# EasyEDA Pro project Class D amp.eprj, schematic Class D amp

## Sheets
1 Power 12V DC: Board Name: MainBoard; Create Date: 2026-04-25; Page Name: Power 12V DC; Project Name: Class D amp; Schematic Name: Class D amp; Update Date: 2026-06-03; Company: zoomMediaPlus; Drawn: Igor Korzinek; Page Size: A4; Version: V1.0
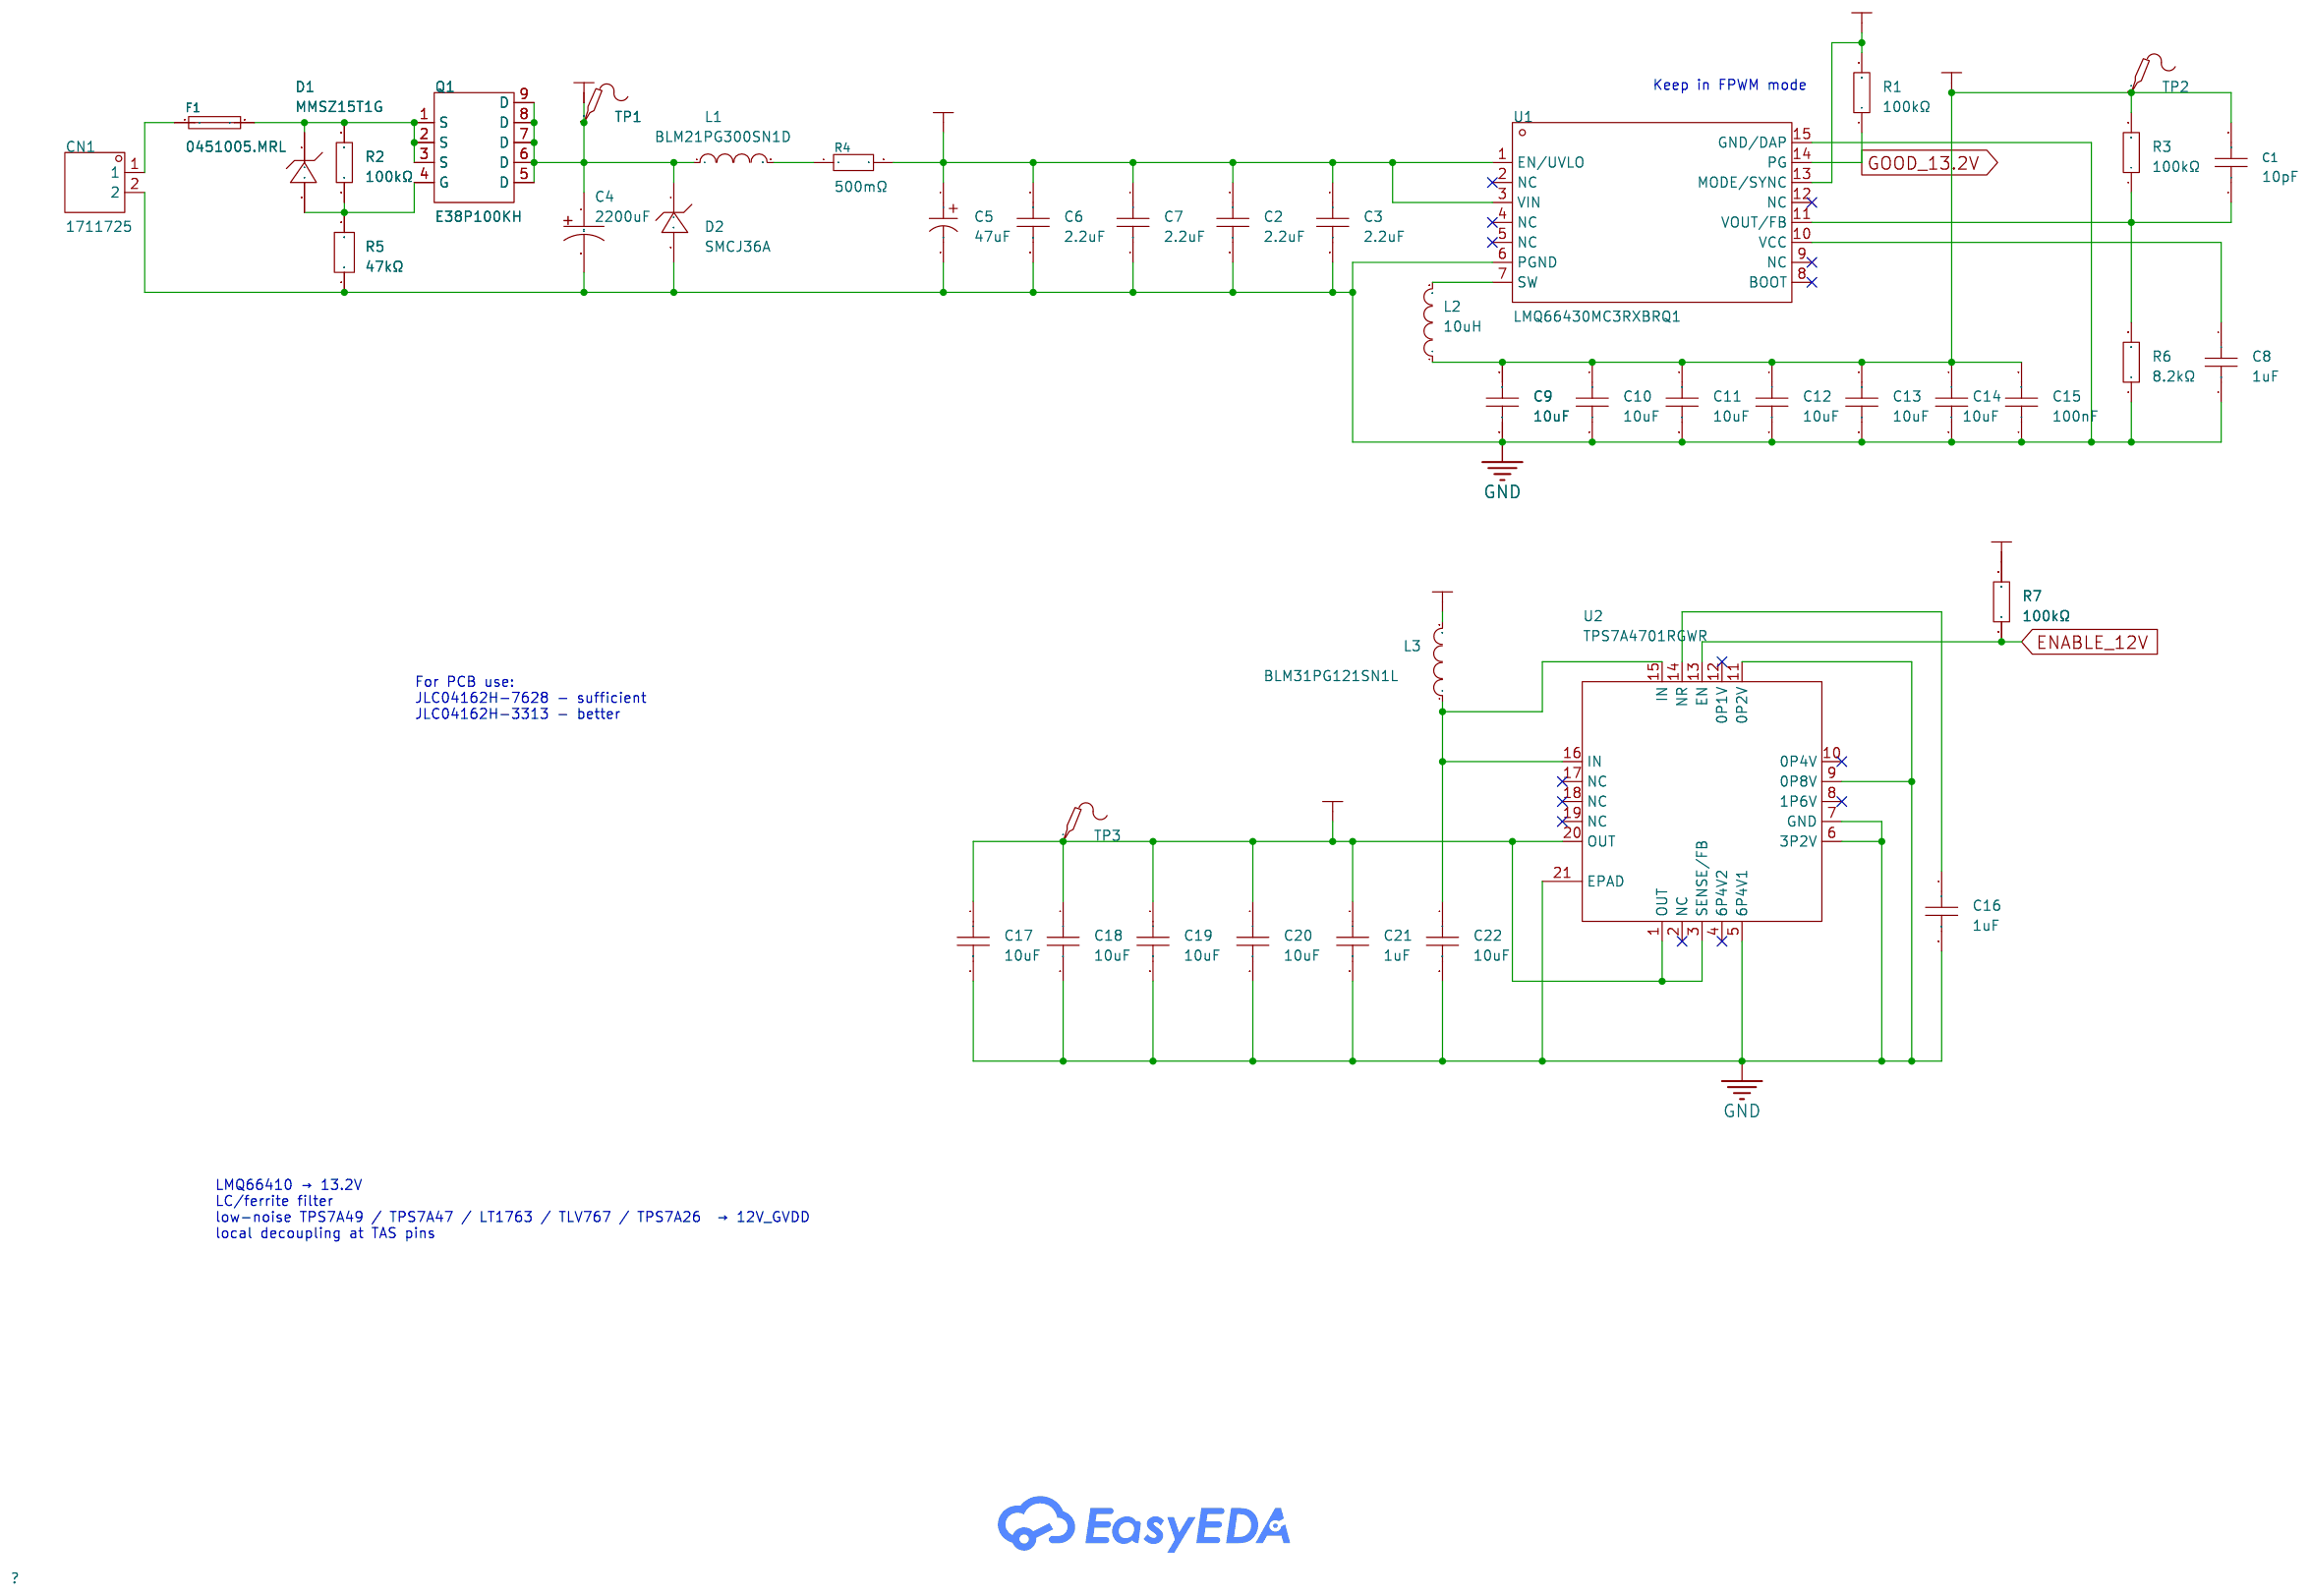
[diagram p0: Power 12V DC]
2 Power 5V DC: Page Name: Power 5V DC; Update Date: 2026-06-02; Company: EasyEDA.com
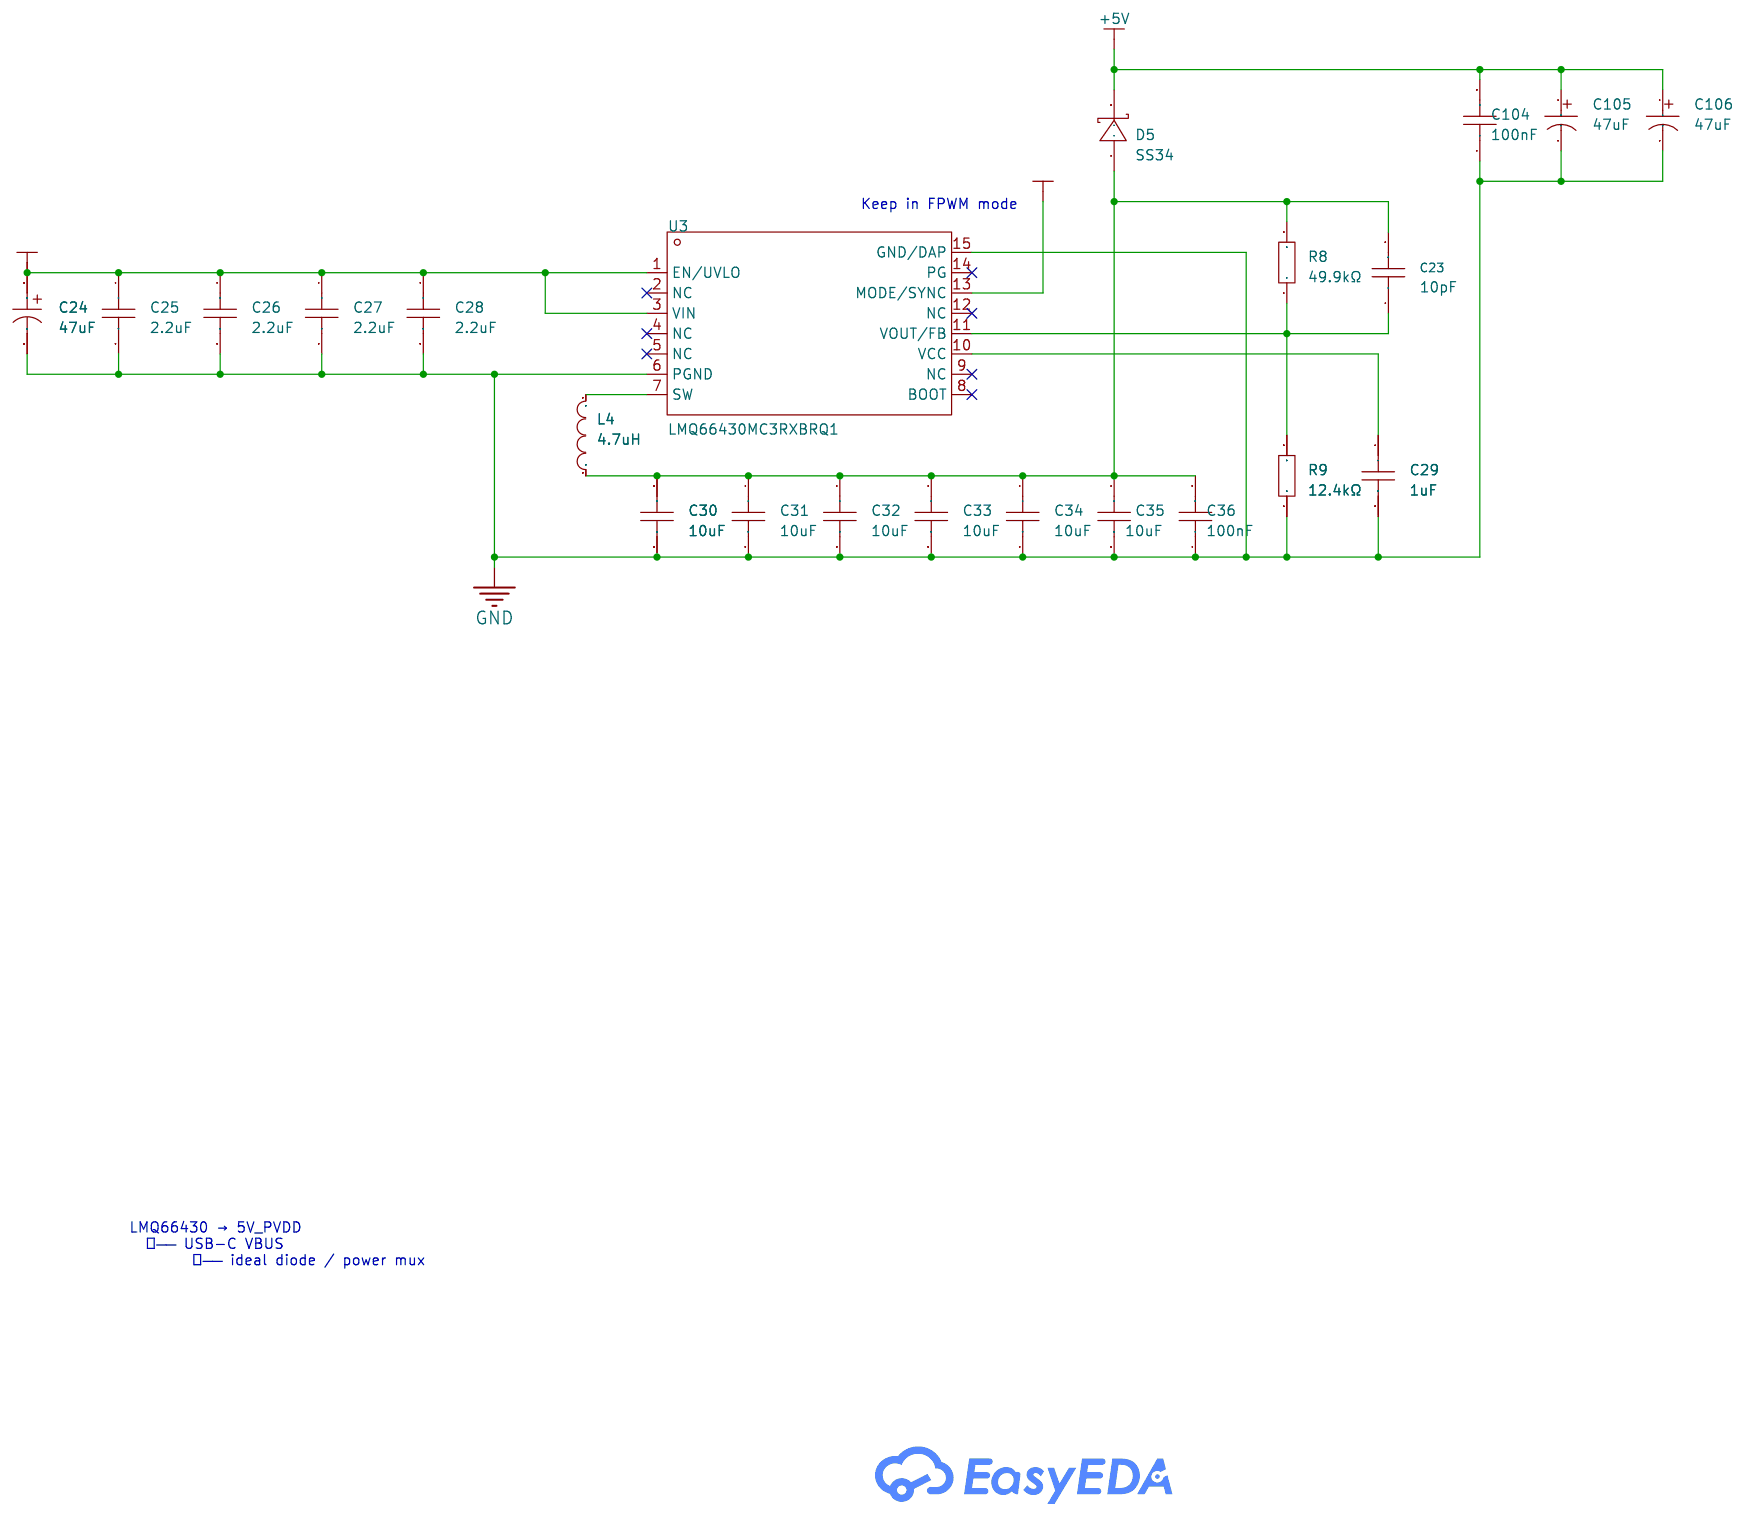
[diagram p1: Power 5V DC]
3 Power 3.3V DC: Page Name: Power 3.3V DC; Update Date: 2026-06-02; Company: EasyEDA.com
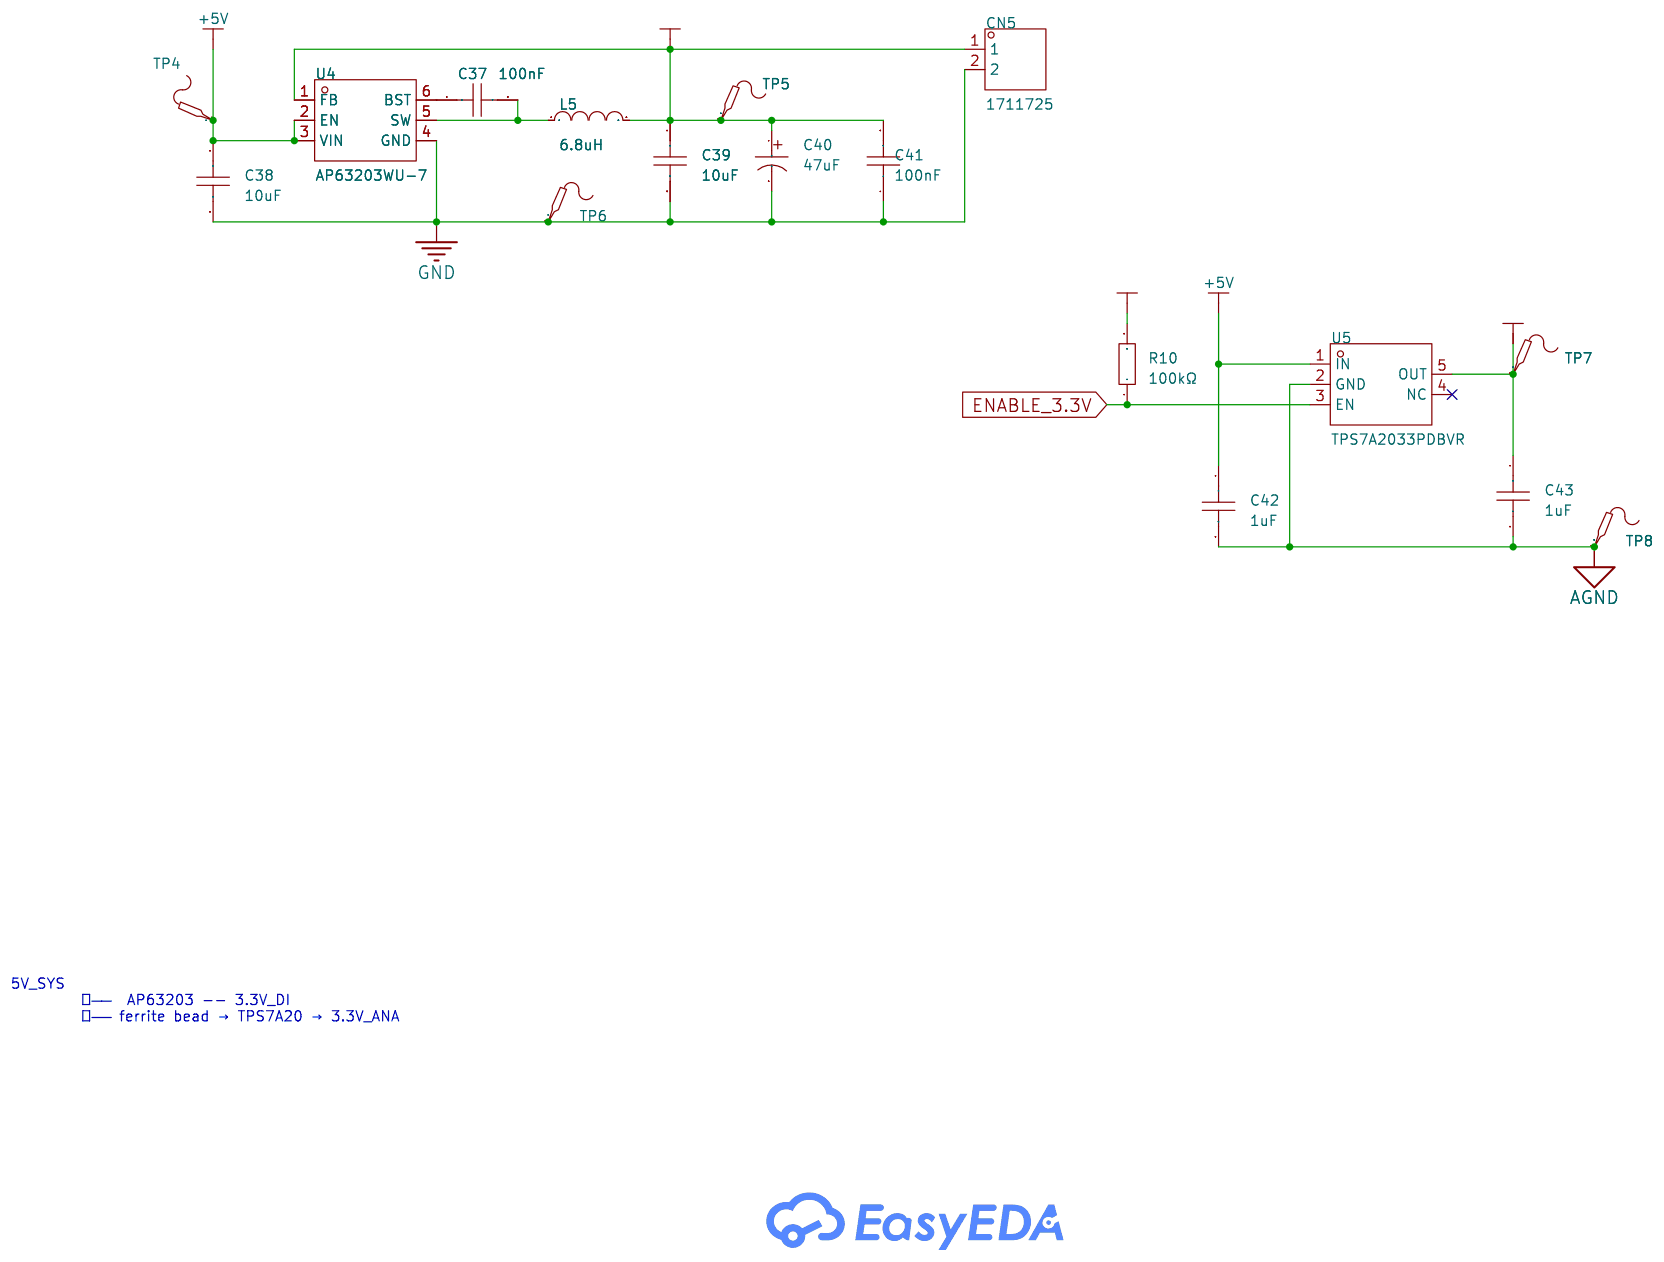
[diagram p2: Power 3.3V DC]
4 Microcontroler: Page Name: Microcontroler; Update Date: 2026-06-05; Company: EasyEDA.com
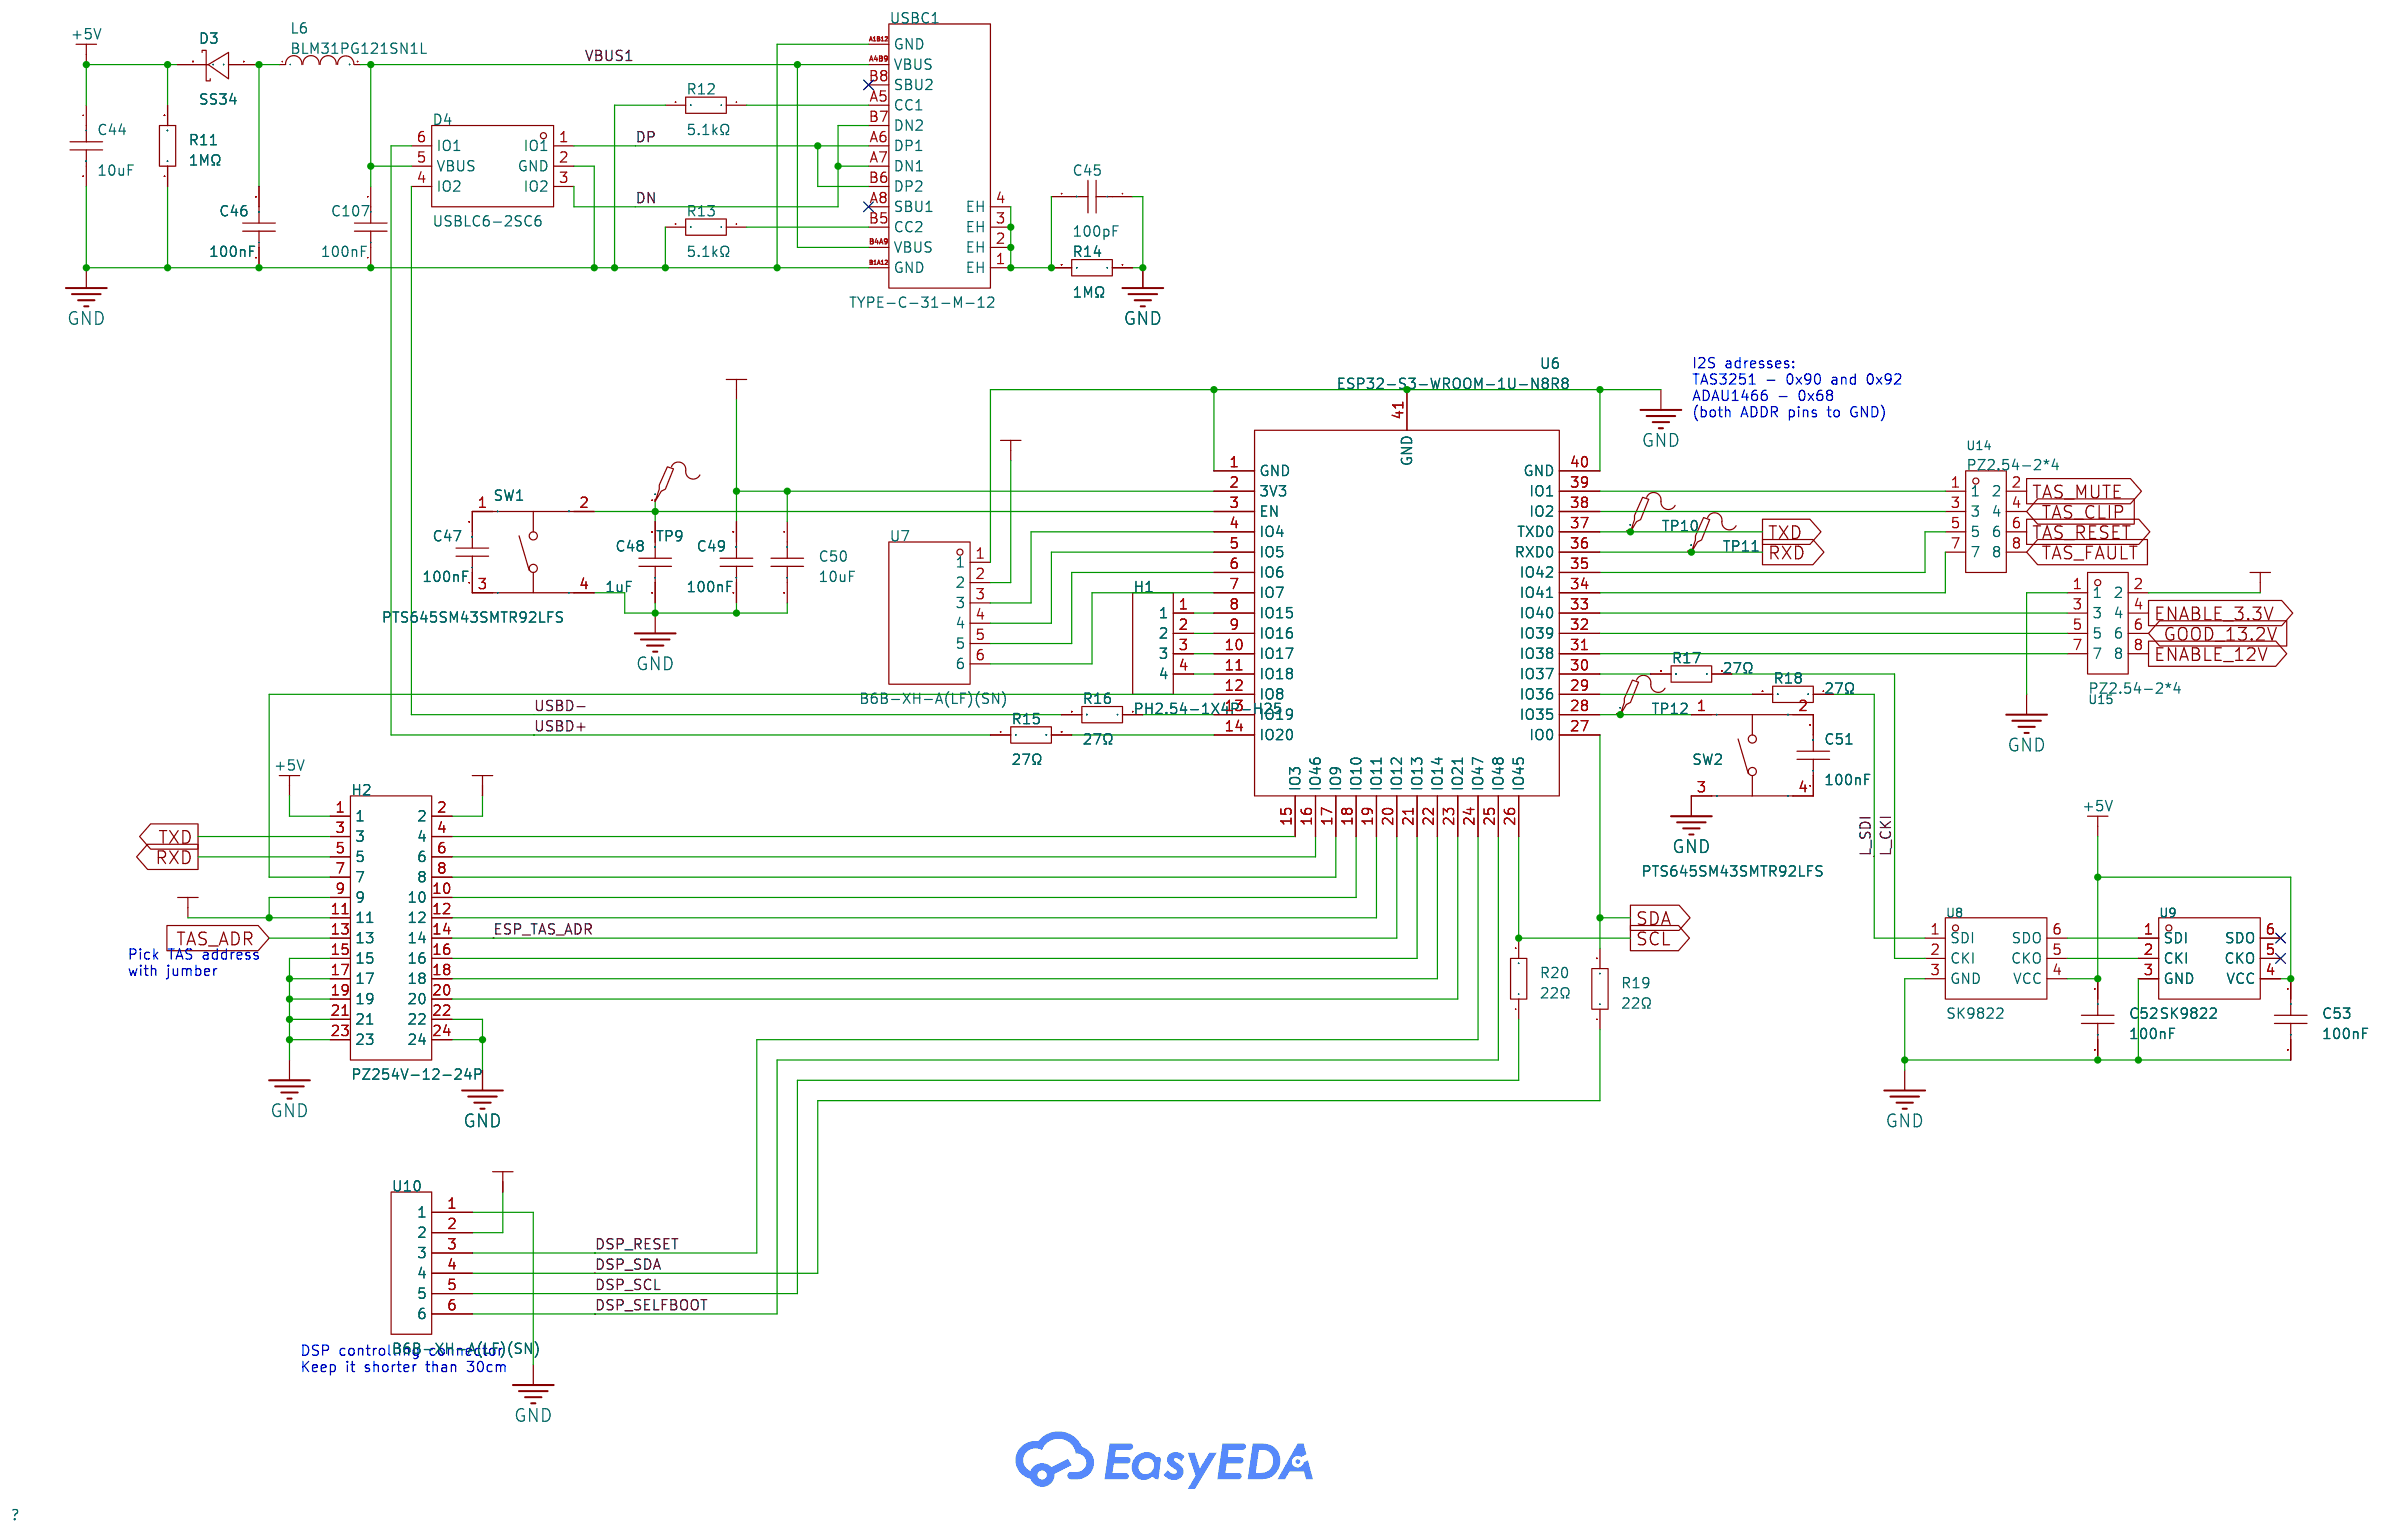
[diagram p3: Microcontroler]
5 Amplifier: Page Name: Amplifier; Update Date: 2026-06-04; Company: EasyEDA.com; Version: V1.1
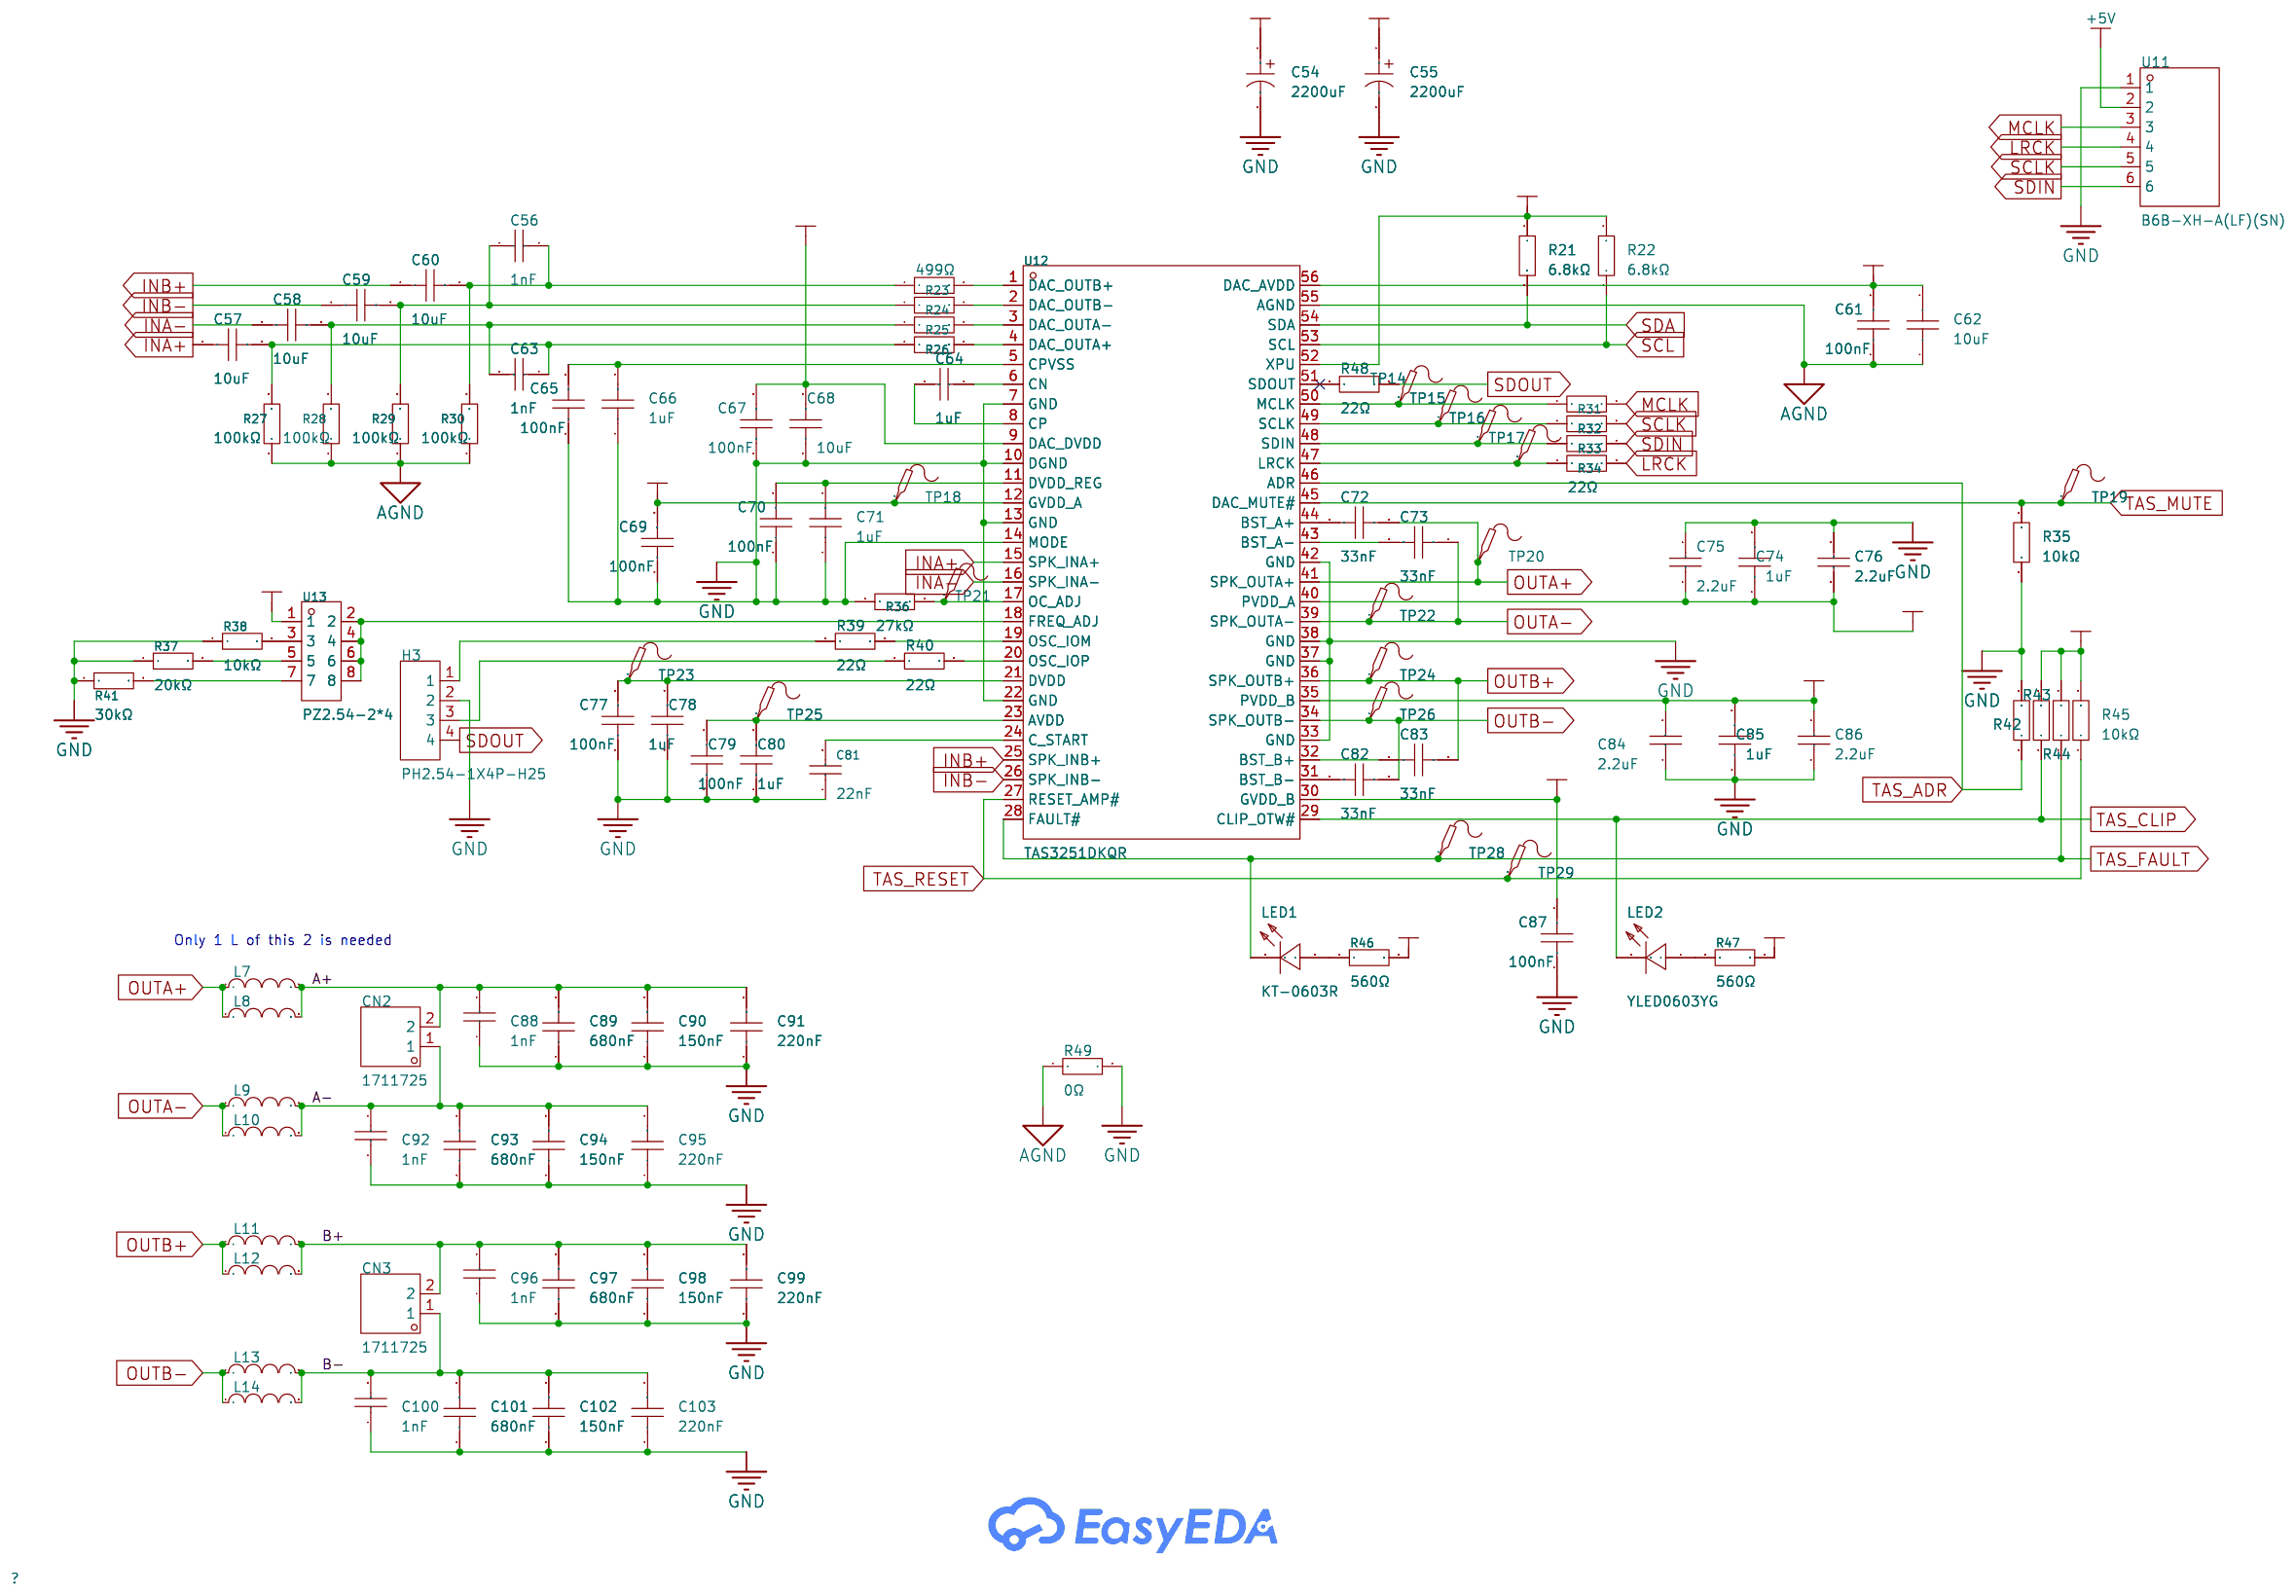
[diagram p4: Amplifier]

## Parts
sheet Amplifier
C54  2200uF  [CAP-TH_BD18.0-P7.5-D0.8-FD]
C55  2200uF  [CAP-TH_BD18.0-P7.5-D0.8-FD]
C56  1nF  [C0402]
C57  10uF  [C1210]
C58  10uF  [C1210]
C59  10uF  [C1210]
C60  10uF  [C1210]
C61  100nF  [C0402]
C62  10uF  [C1210]
C63  1nF  [C0402]
C64  1uF  [C0603]
C65  100nF  [C0402]  (no BOM)
C66  1uF  [C0603]
C67  100nF  [C0402]
C68  10uF  [C1210]
C69  100nF  [C0402]
C70  100nF  [C0402]  (no BOM)
C71  1uF  [C0603]
C72  33nF  [C0805]
C73  33nF  [C0805]
C74  1uF  [CAP-TH_L5.9-W4.2-P5.08-D0.5]
C75  2.2uF  [C1206]
C76  2.2uF  [C1206]
C77  100nF  [C0402]  (no BOM)
C78  1uF  [C0603]
C79  100nF  [C0402]  (no BOM)
C80  1uF  [C0603]
C81  22nF  [C0603]
C82  33nF  [C0805]
C83  33nF  [C0805]
C84  2.2uF  [C1206]
C85  1uF  [CAP-TH_L5.9-W4.2-P5.08-D0.5]
C86  2.2uF  [C1206]
C87  100nF  [C0402]
C88  1nF  [C0402]
C89  680nF  [CAP-TH_L26.0-W12.0-P22.50-D0.8]
C90  150nF  [CAP-TH_L18.0-W10.0-P15.00-D1.2]
C91  220nF  [CAP-TH_L18.3-W10.0-P15.00-D1.0]
C92  1nF  [C0402]
C93  680nF  [CAP-TH_L26.0-W12.0-P22.50-D0.8]
C94  150nF  [CAP-TH_L18.0-W10.0-P15.00-D1.2]
C95  220nF  [CAP-TH_L18.3-W10.0-P15.00-D1.0]
C96  1nF  [C0402]
C97  680nF  [CAP-TH_L26.0-W12.0-P22.50-D0.8]
C98  150nF  [CAP-TH_L18.0-W10.0-P15.00-D1.2]
C99  220nF  [CAP-TH_L18.3-W10.0-P15.00-D1.0]
C100  1nF  [C0402]
C101  680nF  [CAP-TH_L26.0-W12.0-P22.50-D0.8]
C102  150nF  [CAP-TH_L18.0-W10.0-P15.00-D1.2]
C103  220nF  [CAP-TH_L18.3-W10.0-P15.00-D1.0]
CN2  1711725  [CONN-TH_MKDS3-2-5.08]
CN3  1711725  [CONN-TH_MKDS3-2-5.08]
H3  PH2.54-1X4P-H25  [HDR-TH_4P-P2.54-V-M]
L7  -  [IND-SMD_L17.2-W18.2]  (no BOM)
L8  -  [MA5172AE]  (no BOM)
L9  -  [IND-SMD_L17.2-W18.2]  (no BOM)
L10  -  [MA5172AE]  (no BOM)
L11  -  [IND-SMD_L17.2-W18.2]  (no BOM)
L12  -  [MA5172AE]  (no BOM)
L13  -  [IND-SMD_L17.2-W18.2]  (no BOM)
L14  -  [MA5172AE]  (no BOM)
LED1  KT-0603R  [LED-SMD_L1.6-W0.8-R-RD]
LED2  YLED0603YG  [LED0603-FD]
R21  6.8kΩ  [R0402]
R22  6.8kΩ  [R0402]
R23  499Ω  [R0603]
R24  499Ω  [R0603]
R25  499Ω  [R0603]
R26  499Ω  [R0603]
R27  100kΩ  [R0603]
R28  100kΩ  [R0603]
R29  100kΩ  [R0603]
R30  100kΩ  [R0603]
R31  22Ω  [R0402]
R32  22Ω  [R0402]
R33  22Ω  [R0402]
R34  22Ω  [R0402]
R35  10kΩ  [R0603]
R36  27kΩ  [R0402]
R37  20kΩ  [R0603]
R38  10kΩ  [R0603]
R39  22Ω  [R0402]
R40  22Ω  [R0402]
R41  30kΩ  [R0603]
R42  10kΩ  [R0603]
R43  10kΩ  [R0603]
R44  10kΩ  [R0603]
R45  10kΩ  [R0603]
R46  560Ω  [R0402]
R47  560Ω  [R0402]
R48  22Ω  [R0402]
R49  0Ω  [R1206]
TP14  -  [TESTPOINT-SMD_1P-BD1.0]  (no BOM)
TP15  -  [TESTPOINT-SMD_1P-BD1.0]  (no BOM)
TP16  -  [TESTPOINT-SMD_1P-BD1.0]  (no BOM)
TP17  -  [TESTPOINT-SMD_1P-BD1.0]  (no BOM)
TP18  -  [TESTPOINT-SMD_1P-BD1.0]  (no BOM)
TP19  -  [TESTPOINT-SMD_1P-BD1.0]  (no BOM)
TP20  -  [TESTPOINT-SMD_1P-BD1.0]  (no BOM)
TP21  -  [TESTPOINT-SMD_1P-BD1.0]  (no BOM)
TP22  -  [TESTPOINT-SMD_1P-BD1.0]  (no BOM)
TP23  -  [TESTPOINT-SMD_1P-BD1.0]  (no BOM)
TP24  -  [TESTPOINT-SMD_1P-BD1.0]  (no BOM)
TP25  -  [TESTPOINT-SMD_1P-BD1.0]  (no BOM)
TP26  -  [TESTPOINT-SMD_1P-BD1.0]  (no BOM)
TP28  -  [TESTPOINT-SMD_1P-BD1.0]  (no BOM)
TP29  -  [TESTPOINT-SMD_1P-BD1.0]  (no BOM)
U11  B6B-XH-A(LF)(SN)  [CONN-TH_6P-P2.50_B6B-XH-A-LF-SN]
U12  TAS3251DKQR  [SSOP-56_L18.5-W7.6-P0.63-LS10.7-BL]
U13  PZ2.54-2*4  [HDR-TH_8P-P2.54-V-M-R2-C4-S2.54]
sheet Microcontroler
C44  10uF  [C1210]
C45  100pF  [C0402]
C46  100nF  [C0402]
C47  100nF  [C0402]
C48  1uF  [C0603]
C49  100nF  [C0402]
C50  10uF  [C1210]
C51  100nF  [C0402]
C52  100nF  [C0402]
C53  100nF  [C0402]
C107  100nF  [C0402]
D3  SS34  [SMA_L4.3-W2.6-LS5.2-RD]
D4  USBLC6-2SC6  [SOT-23-6_L2.9-W1.6-P0.95-LS2.8-BL]
H1  PH2.54-1X4P-H25  [HDR-TH_4P-P2.54-V-M]
H2  PZ254V-12-24P  [HDR-TH_24P-P2.54-V-M-R2-C12-S2.54]
L6  BLM31PG121SN1L  [L1206]
R11  1MΩ  [R0603]
R12  5.1kΩ  [R0603]
R13  5.1kΩ  [R0603]
R14  1MΩ  [R0603]
R15  27Ω  [R0402]
R16  27Ω  [R0402]
R17  27Ω  [R0402]
R18  27Ω  [R0402]
R19  22Ω  [R0402]
R20  22Ω  [R0402]
SW1  PTS645SM43SMTR92LFS  [KEY-SMD_4P-L6.0-W6.0-P4.50-LS9.0]
SW2  PTS645SM43SMTR92LFS  [KEY-SMD_4P-L6.0-W6.0-P4.50-LS9.0]
TP9  -  [TESTPOINT-SMD_1P-BD1.0]  (no BOM)
TP10  -  [TESTPOINT-SMD_1P-BD1.0]  (no BOM)
TP11  -  [TESTPOINT-SMD_1P-BD1.0]  (no BOM)
TP12  -  [TESTPOINT-SMD_1P-BD1.0]  (no BOM)
U6  2.4GHz  [WIRELM-SMD_ESP32-S3-WROOM-1U]
U7  B6B-XH-A(LF)(SN)  [CONN-TH_6P-P2.50_B6B-XH-A-LF-SN]
U8  SK9822  [SMD_6P-L5.0-W5.0-TL]
U9  SK9822  [SMD_6P-L5.0-W5.0-TL]
U10  B6B-XH-A(LF)(SN)  [CONN-TH_6P-P2.50_B6B-XH-A-LF-SN]
U14  PZ2.54-2*4  [HDR-TH_8P-P2.54-V-M-R2-C4-S2.54]
U15  PZ2.54-2*4  [HDR-TH_8P-P2.54-V-M-R2-C4-S2.54]
USBC1  TYPE-C-31-M-12  [USB-C_SMD-TYPE-C-31-M-12_1]
sheet Power 3.3V DC
C37  100nF  [C0402]
C38  10uF  [C1210]
C39  10uF  [C1210]
C40  47uF  [CAP-SMD_BD6.3-L6.6-W6.6-RD]
C41  100nF  [C0402]
C42  1uF  [C0603]
C43  1uF  [C0603]
CN5  1711725  [CONN-TH_MKDS3-2-5.08]
L5  6.8uH  [IND-SMD_L7.1-W6.6]
R10  100kΩ  [R0603]
TP4  -  [TESTPOINT-SMD_1P-BD1.0]  (no BOM)
TP5  -  [TESTPOINT-SMD_1P-BD1.0]  (no BOM)
TP6  -  [TESTPOINT-SMD_1P-BD1.0]  (no BOM)
TP7  -  [TESTPOINT-SMD_1P-BD1.0]  (no BOM)
TP8  -  [TESTPOINT-SMD_1P-BD1.0]  (no BOM)
U4  AP63203WU-7  [TSOT-26_L2.9-W1.6-P0.95-LS2.8-BL]
U5  TPS7A2033PDBVR  [SOT-23-5_L2.9-W1.6-P0.95-LS2.8-BR]
sheet Power 5V DC
C23  10pF  [C0402]  (no BOM)
C24  47uF  [CAP-SMD_BD6.3-L6.6-W6.6-LS7.2-FD]
C25  2.2uF  [C1206]
C26  2.2uF  [C1206]
C27  2.2uF  [C1206]
C28  2.2uF  [C1206]
C29  1uF  [C1206]
C30  10uF  [C1210]
C31  10uF  [C1210]
C32  10uF  [C1210]
C33  10uF  [C1210]
C34  10uF  [C1210]
C35  10uF  [C1210]
C36  100nF  [C0402]
C104  100nF  [C0402]
C105  47uF  [CAP-SMD_BD6.3-L6.6-W6.6-RD]
C106  47uF  [CAP-SMD_BD6.3-L6.6-W6.6-RD]
D5  SS34  [SMA_L4.3-W2.6-LS5.2-RD]
L4  4.7uH  [IND-SMD_L10.2-W10.0]
R8  49.9kΩ  [R0603]
R9  12.4kΩ  [R0603]
U3  LMQ66430MC3RXBRQ1  [VQFN-14_L2.6-W2.6-P0.50-BL]
sheet Power 12V DC
C1  10pF  [C0402]  (no BOM)
C2  2.2uF  [C1206]
C3  2.2uF  [C1206]
C4  2200uF  [CAP-TH_BD18.0-P7.5-D0.8-FD]
C5  47uF  [CAP-SMD_BD6.3-L6.6-W6.6-LS7.2-FD]
C6  2.2uF  [C1206]
C7  2.2uF  [C1206]
C8  1uF  [C1206]
C9  10uF  [C1210]
C10  10uF  [C1210]
C11  10uF  [C1210]
C12  10uF  [C1210]
C13  10uF  [C1210]
C14  10uF  [C1210]
C15  100nF  [C0402]
C16  1uF  [C0603]
C17  10uF  [C1210]
C18  10uF  [C1210]
C19  10uF  [C1210]
C20  10uF  [C1210]
C21  1uF  [C0603]
C22  10uF  [C1210]
CN1  1711725  [CONN-TH_MKDS3-2-5.08]
D1  MMSZ15T1G  [SOD-123_L2.7-W1.6-LS3.7-RD]
D2  SMCJ36A  [SMC_L7.1-W6.2-LS8.1-RD]
F1  0451005.MRL  [FUSE-SMD_L6.1-W2.6]
L1  BLM21PG300SN1D  [L0805]
L2  10uH  [IND-SMD_L6.7-W6.5]
L3  BLM31PG121SN1L  [L1206]
Q1  E38P100KH  [DFN-8_L6.0-W5.0-P1.27-LS6.2-BL_VBQA2309]
R1  100kΩ  [R0603]
R2  100kΩ  [R0603]
R3  100kΩ  [R0603]
R4  500mΩ  [R2512]
R5  47kΩ  [R0603]
R6  8.2kΩ  [R0603]
R7  100kΩ  [R0603]
TP1  -  [TESTPOINT-SMD_1P-BD1.0]  (no BOM)
TP2  -  [TESTPOINT-SMD_1P-BD1.0]  (no BOM)
TP3  -  [TESTPOINT-SMD_1P-BD1.0]  (no BOM)
U1  LMQ66430MC3RXBRQ1  [VQFN-14_L2.6-W2.6-P0.50-BL]
U2  TPS7A4701RGWR  [VQFN-20_L5.0-W5.0-P0.65-TL-EP]

## Library data of the parts
C4 C54 C55 = NXA 63V 2200UF 18*40: LCSC Part Name: 2200uF ±20% 63V; Supplier Part: C2827938; Manufacturer: SAMYOUNG(韩国三莹); Supplier Footprint: 插件,D18xL40mm; JLCPCB Part Class: Extended Part; Supplier: LCSC; Tolerance: ±20%; Voltage Rating: 63V; Ripple Current: 4.28A@100kHz; Equivalent Series Resistance(ESR): 17mΩ@100kHz; Pin Spacing: 7.5mm; Diameter: 18mm; Height - Seated (Max): 40mm; Lifetime: 10000hrs@105℃; Operating Temperature: -40℃~+105℃
C56 C63 C88 C92 C96 C100 = 0402CG102J500NT: LCSC Part Name: 1nF ±5% 50V; Supplier Part: C53547; Manufacturer: FH(风华); Supplier Footprint: 0402; JLCPCB Part Class: Extended Part; Datasheet: https://item.szlcsc.com/datasheet/0402CG102J500NT/54563.html; Supplier: LCSC; Tolerance: ±5%; Voltage Rating: 50V; Temperature Coefficient: C0G
C57-C60 = CL32B106KAJNNNE: Capacitance:10uF Tolerance:±10% Tolerance:±10% Voltage Rating:25V Temperature Coefficient:X7R; LCSC Part Name: 10uF ±10% 25V; Supplier Part: C39232; Manufacturer: SAMSUNG(三星); Supplier Footprint: 1210; JLCPCB Part Class: Extended Part; Datasheet: https://item.szlcsc.com/datasheet/CL32B106KAJNNNE/40215.html; Supplier: LCSC; Tolerance: ±10%; Voltage Rating: 25V; Temperature Coefficient: X7R
C15 C36 C37 C41 C46 C47 C49 C51-C53 C61 C65 C67 C70 C77 C79 C104 C107 = CL05B104KO5NNNC: Capacitance:100nF Tolerance:±10% Tolerance:±10% Voltage Rating:16V Temperature Coefficient:X7R; LCSC Part Name: 100nF ±10% 16V; Supplier Part: C1525; Manufacturer: SAMSUNG(三星); Supplier Footprint: 0402; JLCPCB Part Class: Basic Part; Datasheet: https://item.szlcsc.com/datasheet/CL05B104KO5NNNC/1877.html; Supplier: LCSC; Tolerance: ±10%; Voltage Rating: 16V; Temperature Coefficient: X7R
C62 C68 = CC1210X7R25V106KN: LCSC Part Name: 10uF ±10% 25V; Supplier Part: C53084464; Manufacturer: TORCH(火炬); Supplier Footprint: 1210; JLCPCB Part Class: Extended Part; Datasheet: https://item.szlcsc.com/datasheet/CC1210X7R25V106KN/56048929.html; Supplier: LCSC; Tolerance: ±10%; Voltage Rating: 25V; Temperature Coefficient: X7R
C64 C66 C71 C78 C80 = CL10B105KB9VPNC: Capacitance:1uF Tolerance:±10% Tolerance:±10% Voltage Rating:50V Temperature Coefficient:X7R; LCSC Part Name: 1uF ±10% 50V; Supplier Part: C16194026; Manufacturer: SAMSUNG(三星); Supplier Footprint: 0603; JLCPCB Part Class: Extended Part; Datasheet: https://item.szlcsc.com/datasheet/CL10B105KB9VPNC/17319102.html; Supplier: LCSC; Tolerance: ±10%; Voltage Rating: 50V; Temperature Coefficient: X7R
C69 C87 = CL05B104KB54PNC: Capacitance:100nF Tolerance:±10% Tolerance:±10% Voltage Rating:50V Temperature Coefficient:X7R; LCSC Part Name: 100nF ±10% 50V; Supplier Part: C307331; Manufacturer: SAMSUNG(三星); Supplier Footprint: 0402; JLCPCB Part Class: Basic Part; Datasheet: https://item.szlcsc.com/datasheet/CL05B104KB54PNC/291005.html; Supplier: LCSC; Tolerance: ±10%; Voltage Rating: 50V; Temperature Coefficient: X7R
C72 C73 C82 C83 = CGA4J1C0G2A333JT0Y0E: Capacitance:33nF Tolerance:±5% Tolerance:±5% Voltage Rating:100V Temperature Coefficient:C0G; LCSC Part Name: 33nF ±5% 100V; Supplier Part: C5139491; Manufacturer: TDK; Supplier Footprint: 0805; JLCPCB Part Class: Extended Part; Datasheet: https://item.szlcsc.com/datasheet/CGA4J1C0G2A333JT0Y0E/5751574.html; Supplier: LCSC; Tolerance: ±5%; Voltage Rating: 100V; Temperature Coefficient: C0G
C74 C85 = CL1210X7R100V105KS: LCSC Part Name: 1uF ±10% 100V; Supplier Part: C53084644; Manufacturer: TORCH(火炬); Supplier Footprint: 插件,P=5.08mm; JLCPCB Part Class: Extended Part; Datasheet: https://item.szlcsc.com/datasheet/CL1210X7R100V105KS/56049109.html; Supplier: LCSC; Tolerance: ±10%; Voltage Rating: 100V; Temperature Coefficient: X7R; Pin Spacing: 5.08mm
C75 C76 C84 C86 = CL31B225KBHNNNE: LCSC Part Name: 2.2uF ±10% 50V; Supplier Part: C50254; Manufacturer: SAMSUNG(三星); Supplier Footprint: 1206; JLCPCB Part Class: Basic Part; Datasheet: https://item.szlcsc.com/datasheet/CL31B225KBHNNNE/51263.html; Supplier: LCSC; Tolerance: ±10%; Voltage Rating: 50V; Temperature Coefficient: X7R
C81 = CL10B223KB8NNNC: LCSC Part Name: 22nF ±10% 50V; Supplier Part: C21122; Manufacturer: SAMSUNG(三星); Supplier Footprint: 0603; JLCPCB Part Class: Basic Part; Datasheet: https://item.szlcsc.com/datasheet/CL10B223KB8NNNC/21834.html; Supplier: LCSC; Tolerance: ±10%; Voltage Rating: 50V; Temperature Coefficient: X7R
C89 C93 C97 C101 = MKP684K310A01: LCSC Part Name: 680nF ±10% 310V 等级:X2; Supplier Part: C434162; Manufacturer: Jimson(智新); Supplier Footprint: 插件,P=22.5mm; JLCPCB Part Class: Extended Part; Datasheet: https://item.szlcsc.com/datasheet/MKP684K310A01/431256.html; Supplier: LCSC; Tolerance: ±10%; Voltage(AC): 310V; Ratings: X2
C90 C94 C98 C102 = MKP154K310A01: LCSC Part Name: 150nF ±10% 310V 等级:X2; Supplier Part: C434218; Manufacturer: Jimson(智新); Supplier Footprint: 插件,P=15mm; JLCPCB Part Class: Extended Part; Datasheet: https://item.szlcsc.com/datasheet/MKP154K310A01/431312.html; Supplier: LCSC; Tolerance: ±10%; Voltage(AC): 310V; Ratings: X2
C91 C95 C99 C103 = MKP224K310A08 THB: LCSC Part Name: 等级:X2 220nF ±10% 310V; Supplier Part: C434236; Manufacturer: Jimson(智新); Supplier Footprint: 插件,P=15mm; JLCPCB Part Class: Extended Part; Datasheet: https://item.szlcsc.com/datasheet/MKP224K310A08%2520THB/431330.html; Supplier: LCSC; Tolerance: ±10%; Voltage(AC): 310V; Ratings: X2
CN1-CN3 CN5 = 1711725: LCSC Part Name: 1x2P 5.08mm 直插 排数:1 每排P数:2; Supplier Part: C89120; Manufacturer: Phoenix Contact(菲尼克斯); Supplier Footprint: 插件,P=5.08mm; JLCPCB Part Class: Extended Part; Datasheet: https://item.szlcsc.com/datasheet/1711725/90300.html; Supplier: LCSC; Number of Positions or Pins: 1x2P; Pitch: 5.08mm; Color: Green; Mounting Type: Through Hole; Number of Pins: 2P; Number of Rows: 1; Number of PINs Per Row: 2; Current Rating: 24A; Voltage Rating (Max): 400V; Wire Gauge - AWG: 12~30
H1 H3 = PH2.54-1X4P-H25: LCSC Part Name: 1x4P 间距:2.54mm 方针 直插; Supplier Part: C42431808; Manufacturer: JXTCONN(聚兴泰); Supplier Footprint: 插件,P=2.54mm; JLCPCB Part Class: Extended Part; Datasheet: https://item.szlcsc.com/datasheet/PH2.54-1X4P-H25/44458938.html; Supplier: LCSC; Pin Structure: 1x4P; Pitch: 2.54mm; Circluar Pins/Square Pins: Pin Header; Mounting Type: Through Hole; Number of Rows: 1; Number of Pins: 4P; Current Rating: 3A; Length of Mating Pin: 6mm; Insulation Height: 2.5mm; Length of End Connection Pin: 3mm; Contact Material: Brass; Contact Plating: Gold; Operating Temperature: -40℃~+105℃; Color: Black
L7 L9 L11 L13 = XGL1712-103MED
L8 L10 L12 L14 = MA5172-AE
LED1 = KT-0603R: LCSC Part Name: 0603 红灯 高亮; Supplier Part: C2286; Manufacturer: KENTO; Supplier Footprint: 0603; JLCPCB Part Class: Basic Part; Datasheet: https://item.szlcsc.com/datasheet/KT-0603R/2659.html; Supplier: LCSC; Lamp Holder Type: 1.6mm x 0.8mm square LED; Illumination Color: Red; Voltage - Forward(Vf): 1.8V~2.4V; Power(Watts): 40mW; Forward Current: 20mA; Wavelength - Dominant: 615nm~630nm; Peak Wavelength: 645nm; Diode Configuration: Discrete Diode; Lens Color: Water Clear; Luminous Intensity: 300mcd; Viewing Angle: 120°; Operating Temperature: -40℃~+85℃
LED2 = YLED0603YG: LCSC Part Name: 黄绿色 独立二极管; Supplier Part: C19171392; Manufacturer: YONGYUTAI(永裕泰); Supplier Footprint: 0603; JLCPCB Part Class: Extended Part; Datasheet: https://item.szlcsc.com/datasheet/YLED0603YG/20382443.html; Supplier: LCSC; Illumination Color: Yellow Green; Voltage - Forward(Vf): 1.8V~2.4V; Forward Current: 30mA; Wavelength - Dominant: 566nm~576nm; Diode Configuration: Discrete Diode; Luminous Intensity: 80mcd; Viewing Angle: 120°; Operating Temperature: -40℃~+85℃
R21 R22 = FRC0402F6801TS: Type:Thick Film Resistor Resistance:6.8kΩ Tolerance:±1% Tolerance:±1% Power(Watts):62.5mW Voltage-Supply(Max):50V Temperature Coefficient:±100ppm/℃ Temperature Coefficient:±100ppm/℃ Operating Temperature:-55℃~+155℃ Operating Temperature:-55℃~+155℃; LCSC Part Name: 6.8kΩ ±1% 62.5mW 厚膜电阻; Supplier Part: C2906876; Manufacturer: FOJAN(富捷); Supplier Footprint: 0402; JLCPCB Part Class: Extended Part; Supplier: LCSC; Type: Thick Film Resistor; Tolerance: ±1%; Power(Watts): 62.5mW; Voltage-Supply(Max): 50V; Temperature Coefficient: ±100ppm/℃; Operating Temperature: -55℃~+155℃
R23-R26 = RMC06034991%N: LCSC Part Name: 499Ω ±1% 100mW; Supplier Part: C269426; Manufacturer: Tyohm(幸亚电阻); Supplier Footprint: 0603; JLCPCB Part Class: Extended Part; Datasheet: https://item.szlcsc.com/datasheet/RMC06034991%2525N/258866.html; Supplier: LCSC; Type: Thick Film Resistor; Tolerance: ±1%; Power(Watts): 100mW; Voltage-Supply(Max): 50V; Temperature Coefficient: ±100ppm/℃; Operating Temperature: -55℃~+155℃
R27-R30 = RMC0603100K1%N: LCSC Part Name: 100kΩ ±1% 100mW; Supplier Part: C269699; Manufacturer: Tyohm(幸亚电阻); Supplier Footprint: 0603; JLCPCB Part Class: Extended Part; Datasheet: https://item.szlcsc.com/datasheet/RMC0603100K1%2525N/259139.html; Supplier: LCSC; Type: Thick Film Resistor; Tolerance: ±1%; Power(Watts): 100mW; Voltage-Supply(Max): 50V; Temperature Coefficient: ±100ppm/℃; Operating Temperature: -55℃~+155℃
R31-R34 = 0402WGF220JTCE: LCSC Part Name: 22Ω ±1% 62.5mW 厚膜电阻; Supplier Part: C25092; Manufacturer: UNI-ROYAL(厚声); Supplier Footprint: 0402; JLCPCB Part Class: Basic Part; Datasheet: https://atta.szlcsc.com/upload/public/pdf/source/20200306/C422600_1E6D84923E4A46A82E41ADD87F860B5C.pdf; Supplier: LCSC; Type: Thick Film Resistors; Tolerance: ±1%; Temperature Coefficient: ±100ppm/℃; Operating Temperature Range: -55℃~+155℃
R35 R42-R45 = 0603WAF1002T5E: Type:Thick Film Resistor Resistance:10kΩ Tolerance:±1% Tolerance:±1% Power(Watts):100mW Voltage-Supply(Max):75V Temperature Coefficient:±100ppm/℃ Temperature Coefficient:±100ppm/℃ Operating Temperature:-55℃~+155℃ Operating Temperature:-55℃~+155℃; LCSC Part Name: 厚膜电阻 10kΩ ±1% 100mW; Supplier Part: C25804; Manufacturer: UNI-ROYAL(厚声); Supplier Footprint: 0603; JLCPCB Part Class: Basic Part; Datasheet: https://item.szlcsc.com/datasheet/0603WAF1002T5E/26547.html; Supplier: LCSC; Type: Thick Film Resistor; Tolerance: ±1%; Power(Watts): 100mW; Voltage-Supply(Max): 75V; Temperature Coefficient: ±100ppm/℃; Operating Temperature: -55℃~+155℃
R36 = 0402WGF2702TCE: Type:Thick Film Resistor Resistance:27kΩ Tolerance:±1% Tolerance:±1% Power(Watts):62.5mW Voltage-Supply(Max):50V Temperature Coefficient:±100ppm/℃ Temperature Coefficient:±100ppm/℃ Operating Temperature:-55℃~+155℃ Operating Temperature:-55℃~+155℃; LCSC Part Name: 27kΩ ±1% 62.5mW 厚膜电阻; Supplier Part: C25771; Manufacturer: UNI-ROYAL(厚声); Supplier Footprint: 0402; JLCPCB Part Class: Extended Part; Datasheet: https://item.szlcsc.com/datasheet/0402WGF2702TCE/26514.html; Supplier: LCSC; Type: Thick Film Resistor; Tolerance: ±1%; Power(Watts): 62.5mW; Voltage-Supply(Max): 50V; Temperature Coefficient: ±100ppm/℃; Operating Temperature: -55℃~+155℃
R37 = FRC0603F2002TS: Type:Thick Film Resistor Resistance:20kΩ Tolerance:±1% Tolerance:±1% Power(Watts):100mW Voltage-Supply(Max):75V Temperature Coefficient:±100ppm/℃ Temperature Coefficient:±100ppm/℃ Operating Temperature:-55℃~+155℃ Operating Temperature:-55℃~+155℃; LCSC Part Name: 20kΩ ±1% 100mW 厚膜电阻; Supplier Part: C2907011; Manufacturer: FOJAN(富捷); Supplier Footprint: 0603; JLCPCB Part Class: Extended Part; Supplier: LCSC; Type: Thick Film Resistor; Tolerance: ±1%; Power(Watts): 100mW; Voltage-Supply(Max): 75V; Temperature Coefficient: ±100ppm/℃; Operating Temperature: -55℃~+155℃
R38 = FRC0603J103 TS: Type:Thick Film Resistor Resistance:10kΩ Tolerance:±5% Tolerance:±5% Power(Watts):100mW Voltage-Supply(Max):75V Temperature Coefficient:±100ppm/℃ Temperature Coefficient:±100ppm/℃ Operating Temperature:-55℃~+155℃ Operating Temperature:-55℃~+155℃; LCSC Part Name: 10kΩ ±5% 100mW 厚膜电阻; Supplier Part: C2930027; Manufacturer: FOJAN(富捷); Supplier Footprint: 0603; JLCPCB Part Class: Extended Part; Datasheet: https://item.szlcsc.com/datasheet/FRC0603J103%2520TS/3266960.html; Supplier: LCSC; Type: Thick Film Resistor; Tolerance: ±5%; Power(Watts): 100mW; Voltage-Supply(Max): 75V; Temperature Coefficient: ±100ppm/℃; Operating Temperature: -55℃~+155℃
R19 R20 R39 R40 R48 = RC0402FR-0722RL: LCSC Part Name: 厚膜电阻 22Ω ±1% 62.5mW; Supplier Part: C114765; Manufacturer: YAGEO(国巨); Supplier Footprint: 0402; JLCPCB Part Class: Extended Part; Datasheet: https://atta.szlcsc.com/upload/public/pdf/source/20180821/C275644_0D56F95EFF785E7D9A1FEF436B37DA78.pdf; Supplier: LCSC; Type: Thick Film Resistors; Tolerance: ±1%; Temperature Coefficient: ±100ppm/℃; Operating Temperature Range: -55℃~+155℃
R41 = FRC0603F3002TS: Type:Thick Film Resistor Resistance:30kΩ Tolerance:±1% Tolerance:±1% Power(Watts):100mW Voltage-Supply(Max):75V Temperature Coefficient:±100ppm/℃ Temperature Coefficient:±100ppm/℃ Operating Temperature:-55℃~+155℃ Operating Temperature:-55℃~+155℃; LCSC Part Name: 30kΩ ±1% 100mW 厚膜电阻; Supplier Part: C2907025; Manufacturer: FOJAN(富捷); Supplier Footprint: 0603; JLCPCB Part Class: Extended Part; Supplier: LCSC; Type: Thick Film Resistor; Tolerance: ±1%; Power(Watts): 100mW; Voltage-Supply(Max): 75V; Temperature Coefficient: ±100ppm/℃; Operating Temperature: -55℃~+155℃
R46 R47 = 0402WGF5600TCE: LCSC Part Name: 560Ω ±1% 62.5mW 厚膜电阻; Supplier Part: C25126; Manufacturer: UNI-ROYAL(厚声); Supplier Footprint: 0402; JLCPCB Part Class: Extended Part; Datasheet: https://item.szlcsc.com/datasheet/0402WGF5600TCE/25869.html; Supplier: LCSC; Type: Thick Film Resistor; Tolerance: ±1%; Power(Watts): 62.5mW; Voltage-Supply(Max): 50V; Temperature Coefficient: ±100ppm/℃; Operating Temperature: -55℃~+155℃
R49 = FRC1206P000 TS: Type:Thick Film Resistor Resistance:0Ω Tolerance:±5% Tolerance:±5% Power(Watts):250mW Voltage-Supply(Max):200V Operating Temperature:-55℃~+155℃ Operating Temperature:-55℃~+155℃; LCSC Part Name: 0Ω ±5% 250mW 厚膜电阻; Supplier Part: C2907406; Manufacturer: FOJAN(富捷); Supplier Footprint: 1206; JLCPCB Part Class: Extended Part; Supplier: LCSC; Type: Thick Film Resistor; Tolerance: ±5%; Power(Watts): 250mW; Voltage-Supply(Max): 200V; Operating Temperature: -55℃~+155℃
TP1-TP12 TP14-TP26 TP28 TP29 = Test-Point: Test Point 测试点
U7 U10 U11 = B6B-XH-A(LF)(SN): LCSC Part Name: 1x6P 间距:2.5mm 直插 系列:XH; Supplier Part: C144397; Manufacturer: JST; Supplier Footprint: 插件,P=2.5mm; JLCPCB Part Class: Extended Part; Datasheet: https://item.szlcsc.com/datasheet/B6B-XH-A(LF)(SN)/155729.html; Supplier: LCSC; Pins Structure: 1x6P; Pitch: 2.5mm; Mounting Type: Through Hole; Reference Series: XH; Number of Pins: 6P; Number of Rows: 1; Number of PINs Per Row: 6; Current Rating: 3A; Contact Material: Brass; Contact Plating: Tin; Operating Temperature: -25℃~+85℃; Voltage Rating: 250V; Plastic Material: PA66; Flame Retardant Rating: UL94V-0; Supplementary Features: K Pin; Color: White; Z-Height of the Board: 7mm; X-Length of Bottom Edge on Board (Spacing Line): 17.4mm; Y-Width of Bottom Edge on Board: 5.75mm
U12 = TAS3251DKQR: LCSC Part Name: 具有高级DSP处理功能的立体声、单声道超高清数字输入D类放大器; Supplier Part: C544648; Manufacturer: TI(德州仪器); Supplier Footprint: SSOP-56-300mil; JLCPCB Part Class: Extended Part; Datasheet: https://www.ti.com/cn/lit/gpn/tas3251; Supplier: LCSC; Class: Class D; Speaker Channels: 2-Channel；1-Channel; Output Power: 175W×2@4Ω；220W×2@3Ω；350W×1@2Ω；140W×2@4Ω；155W×1@4Ω；285W×1@2Ω; Signal-to-Noise Ratio: 108dB; Power Supply Rejection Ratio (PSRR): 60dB; Efficiency: 90%; Features: Digital programmable gain；Built-in audio processing；Configurable output topology; Voltage - Supply: 12V~36V; Operating Temperature: 0℃~+125℃
U13-U15 = PZ2.54-2*4: LCSC Part Name: 2x4P 间距:2.54mm 方针 直插; Supplier Part: C5156676; Manufacturer: ZHOURI(洲日); Supplier Footprint: 插件,P=2.54mm; JLCPCB Part Class: Extended Part; Datasheet: https://item.szlcsc.com/datasheet/PZ2.54-2*4/5790845.html; Supplier: LCSC; Pin Structure: 2x4P; Pitch: 2.54mm; Row Spacing: 2.54mm; Circluar Pins/Square Pins: Pin Header; Mounting Type: Through Hole; Number of Rows: 2; Number of Pins: 8P; Current Rating: 2.5A; Length of Mating Pin: 6mm; Insulation Height: 2.54mm; Length of End Connection Pin: 3mm; Contact Material: Brass; Contact Plating: Gold; Operating Temperature: -40℃~+105℃
C9-C14 C17-C20 C22 C30-C35 C38 C39 C44 C50 = CC1210KKX7R9BB106: Capacitance:10uF Tolerance:±10% Tolerance:±10% Voltage Rating:50V Temperature Coefficient:X7R; LCSC Part Name: 10uF ±10% 50V; Supplier Part: C596319; Manufacturer: YAGEO(国巨); Supplier Footprint: 1210; JLCPCB Part Class: Extended Part; Datasheet: https://item.szlcsc.com/datasheet/CC1210KKX7R9BB106/624303.html; Supplier: LCSC; Tolerance: ±10%; Voltage Rating: 50V; Temperature Coefficient: X7R
C45 = 0402CG101J500NT: Capacitance:100pF Tolerance:±5% Tolerance:±5% Voltage Rating:50V Temperature Coefficient:C0G; LCSC Part Name: 100pF ±5% 50V; Supplier Part: C1546; Manufacturer: FH(风华); Supplier Footprint: 0402; JLCPCB Part Class: Basic Part; Datasheet: https://item.szlcsc.com/datasheet/0402CG101J500NT/1898.html; Supplier: LCSC; Tolerance: ±5%; Voltage Rating: 50V; Temperature Coefficient: C0G
C48 = CGA3E1X7R1E105KT0Y0S: Capacitance:1uF Voltage Rating:25V Temperature Coefficient:X7R; LCSC Part Name: 1uF 25V; Supplier Part: C5159427; Manufacturer: TDK; JLCPCB Part Class: Extended Part; Supplier: LCSC; Voltage Rating: 25V; Temperature Coefficient: X7R
D3 D5 = SS34_C8678: Diode Configuration:Independent Voltage - Forward(Vf@If):550mV@3A Voltage - DC Reverse(Vr):40V Current - Rectified:3A Reverse Leakage Current (Ir):500uA@40V Operating Junction Temperature Range:-55℃~+125℃ Operating Junction Temperature Range:-55℃~+125℃; LCSC Part Name: 电压:40V 电流:3A; Supplier Part: C8678; Manufacturer: MDD(辰达半导体); Supplier Footprint: SMA(DO-214AC); JLCPCB Part Class: Basic Part; Datasheet: https://item.szlcsc.com/datasheet/SS34/9178.html; Supplier: LCSC; Diode Configuration: Independent; Voltage - Forward(Vf@If): 550mV@3A; Voltage - DC Reverse(Vr): 40V; Current - Rectified: 3A; Reverse Leakage Current (Ir): 500uA@40V; Operating Junction Temperature Range: -55℃~+125℃
D4 = USBLC6-2SC6_C2827654: LCSC Part Name: ESD，可防30kV静电; Supplier Part: C2827654; Manufacturer: TECH PUBLIC(台舟); Supplier Footprint: SOT-23-6; JLCPCB Part Class: Extended Part; Datasheet: https://item.szlcsc.com/datasheet/USBLC6-2SC6/2973336.html; Supplier: LCSC; Polarity: Unidirectional; Reverse Stand-Off Voltage (Vrwm): 5V; Clamping Voltage: 12V; Peak Pulse Current (Ipp): 6A; Peak Pulse Power Dissipation (Ppp): 150W; Voltage - Breakdown: 6V; Reverse Leakage Current (Ir): 80nA; Number of Channels: 2; Operating Temperature: -55℃~+125℃; level of protection: IEC 61000-4-2；IEC 61000-4-4；IEC 61000-4-5; Type: ESD; Junction Capacitance: 0.35pF
H2 = PZ254V-12-24P: LCSC Part Name: 2x12P 间距:2.54mm 方针 直插; Supplier Part: C492429; Manufacturer: XFCN(兴飞); Supplier Footprint: 插件,P=2.54mm; JLCPCB Part Class: Extended Part; Datasheet: https://item.szlcsc.com/datasheet/PZ254V-12-24P/502985.html; Supplier: LCSC; Pin Structure: 2x12P; Pitch: 2.54mm; Row Spacing: 2.54mm; Circluar Pins/Square Pins: Pin Header; Mounting Type: Through Hole; Number of Rows: 2; Number of Pins: 24P; Length of Mating Pin: 6mm; Insulation Height: 2.5mm; Length of End Connection Pin: 3mm; Contact Material: Brass; Operating Temperature: -40℃~+105℃; Color: Black
L3 L6 = BLM31PG121SN1L: LCSC Part Name: 单路 1206磁珠 阻抗120Ω@100MHz; Supplier Part: C85841; Manufacturer: muRata(村田); Supplier Footprint: 1206; JLCPCB Part Class: Extended Part; Datasheet: https://item.szlcsc.com/datasheet/BLM31PG121SN1L/87017.html; Supplier: LCSC; Impedance @ Frequency: 120Ω@100MHz; Tolerance: ±25%; DC Resistance(DCR): 20mΩ; Current Rating: 3.5A; Number of Circuits: 1; Operating Temperature: -55℃~+125℃
R11 R14 = RMC06031M1%N: Type:Thick Film Resistor Resistance:1MΩ Tolerance:±1% Tolerance:±1% Power(Watts):100mW Voltage-Supply(Max):50V Temperature Coefficient:±100ppm/℃ Temperature Coefficient:±100ppm/℃ Operating Temperature:-55℃~+155℃ Operating Temperature:-55℃~+155℃; LCSC Part Name: 厚膜电阻 1MΩ ±1% 100mW; Supplier Part: C269705; Manufacturer: Tyohm(幸亚电阻); Supplier Footprint: 0603; JLCPCB Part Class: Extended Part; Datasheet: https://item.szlcsc.com/datasheet/RMC06031M1%2525N/259145.html; Supplier: LCSC; Type: Thick Film Resistor; Tolerance: ±1%; Power(Watts): 100mW; Voltage-Supply(Max): 50V; Temperature Coefficient: ±100ppm/℃; Operating Temperature: -55℃~+155℃
R12 R13 = RMC06035.1K1%N: Type:Thick Film Resistor Resistance:5.1kΩ Tolerance:±1% Tolerance:±1% Power(Watts):100mW Voltage-Supply(Max):50V Temperature Coefficient:±100ppm/℃ Temperature Coefficient:±100ppm/℃ Operating Temperature:-55℃~+155℃ Operating Temperature:-55℃~+155℃; LCSC Part Name: 厚膜电阻 5.1kΩ ±1% 100mW; Supplier Part: C269716; Manufacturer: Tyohm(幸亚电阻); Supplier Footprint: 0603; JLCPCB Part Class: Extended Part; Datasheet: https://item.szlcsc.com/datasheet/RMC06035.1K1%2525N/259156.html; Supplier: LCSC; Type: Thick Film Resistor; Tolerance: ±1%; Power(Watts): 100mW; Voltage-Supply(Max): 50V; Temperature Coefficient: ±100ppm/℃; Operating Temperature: -55℃~+155℃
R15-R18 = RC0402FR-0727RL: LCSC Part Name: 厚膜电阻 27Ω ±1% 62.5mW; Supplier Part: C138021; Manufacturer: YAGEO(国巨); Supplier Footprint: 0402; JLCPCB Part Class: Extended Part; Datasheet: https://item.szlcsc.com/datasheet/RC0402FR-0727RL/149337.html; Supplier: LCSC; Type: Thick Film Resistor; Tolerance: ±1%; Power(Watts): 62.5mW; Voltage-Supply(Max): 50V; Temperature Coefficient: ±100ppm/℃; Operating Temperature: -55℃~+155℃
SW1 SW2 = PTS645SM43SMTR92LFS: LCSC Part Name: 轻触开关6mm*6mm，160gf; Supplier Part: C221880; Manufacturer: C&K; Supplier Footprint: SMD-4P,6x6mm; JLCPCB Part Class: Extended Part; Datasheet: https://item.szlcsc.com/datasheet/PTS645SM43SMTR92LFS/222310.html; Supplier: LCSC; Circuit: SPST; Actuator Style: Round Button; Operating Force: 1.6N; Mounting Type: Surface Mount,Vertical; Length: 6mm; Width: 6mm; Switch Height: 4.3mm; Contact Current: 50mA; Voltage Rating: 12V; Termination Style: Gull Wing; Operating Temperature: -20℃~+85℃
U6 = ESP32-S3-WROOM-1U-N8R8: LCSC Part Name: 不带固件 通用型Wi-Fi+低功耗蓝牙MCU模组; Supplier Part: C2980300; Manufacturer: ESPRESSIF(乐鑫); Supplier Footprint: SMD,19.2x18mm; JLCPCB Part Class: Extended Part; Datasheet: https://item.szlcsc.com/datasheet/ESP32-S3-WROOM-1U-N8R8/3401552.html; Supplier: LCSC; Utilized IC / Part: ESP32-S3R8; Wireless Standard: Bluetooth5.0; Interface Type: I2C；GPIO；UART；SPI；USB；I2S; Output Power: 20.5dBm; Voltage - Supply: 3V~3.6V; Receive  Current: 95mA; Send  Current: 355mA; Sensitivity: -103.5dBm; Operating Temperature: -40℃~+65℃
U8 U9 = SK9822: LCSC Part Name: PWM调光; Supplier Part: C2829089; Manufacturer: 欧思科光电; Supplier Footprint: SMD-6P,5.5x5mm; JLCPCB Part Class: Extended Part; Datasheet: https://item.szlcsc.com/datasheet/SK9822/2978092.html; Supplier: LCSC; Voltage - Input(DC): 4.5V~5.5V; Frequency - Switching: 30MHz; Number of Channels: 2; Output Current: 20mA; Dimming: PWM; Operating temperature: -20℃~+80℃; Switch Tube (Built-In/External): Built-in
USBC1 = TYPE-C-31-M-12: LCSC Part Name: Type-C 母 卧贴; Supplier Part: C165948; Manufacturer: 韩国韩荣; Supplier Footprint: SMD; JLCPCB Part Class: Extended Part; Datasheet: https://item.szlcsc.com/datasheet/TYPE-C-31-M-12/177331.html; Supplier: LCSC; Connector Type: Type-C; Gender: Female; Mounting Type: Surface Mount, Right Angle; Number of Contacts: 16P; Number of Ports: 1; Current Rating-Power: 5A; Voltage Rating: 20V; Connect-Disconnect Life: 10,000 cycles; Length: 7.35mm; Operating Temperature: -30℃~+80℃
C40 C105 C106 = VES470M1HTR-0607: LCSC Part Name: 47uF ±20% 50V; Supplier Part: C108053; Manufacturer: Lelon(立隆); Supplier Footprint: SMD,D6.3xL7.7mm; JLCPCB Part Class: Extended Part; Datasheet: https://item.szlcsc.com/datasheet/VES470M1HTR-0607/109272.html; Supplier: LCSC; Tolerance: ±20%; Voltage Rating: 50V; Diameter: 6.3mm; Height - Seated (Max): 7.7mm; Lifetime: 1000hrs@105℃; Operating Temperature: -45℃~+105℃
C16 C21 C42 C43 = CL10B105KB8NQNC: Capacitance:1uF Tolerance:±10% Tolerance:±10% Voltage Rating:50V Temperature Coefficient:X7R; LCSC Part Name: 1uF ±10% 50V; Supplier Part: C5199872; Manufacturer: SAMSUNG(三星); Supplier Footprint: 0603; JLCPCB Part Class: Extended Part; Datasheet: https://item.szlcsc.com/datasheet/CL10B105KB8NQNC/5885909.html; Supplier: LCSC; Tolerance: ±10%; Voltage Rating: 50V; Temperature Coefficient: X7R
L5 = SLO0630H6R8MTT: Inductance:6.8uH Tolerance:±20% Tolerance:±20% Current Rating:- DC Resistance(DCR):-; LCSC Part Name: 6.8uH ±20%; Supplier Part: C207841; Manufacturer: Sunltech(顺磁); Supplier Footprint: SMD,7.3x6.6mm; JLCPCB Part Class: Extended Part; Datasheet: https://item.szlcsc.com/datasheet/SLO0630H6R8MTT/208916.html; Supplier: LCSC; Tolerance: ±20%
R1-R3 R7 R10 = RMC0603100K1%N: Type:Thick Film Resistor Resistance:100kΩ Tolerance:±1% Tolerance:±1% Power(Watts):100mW Voltage-Supply(Max):50V Temperature Coefficient:±100ppm/℃ Temperature Coefficient:±100ppm/℃ Operating Temperature:-55℃~+155℃ Operating Temperature:-55℃~+155℃; LCSC Part Name: 100kΩ ±1% 100mW; Supplier Part: C269699; Manufacturer: Tyohm(幸亚电阻); Supplier Footprint: 0603; JLCPCB Part Class: Extended Part; Datasheet: https://item.szlcsc.com/datasheet/RMC0603100K1%2525N/259139.html; Supplier: LCSC; Type: Thick Film Resistor; Tolerance: ±1%; Power(Watts): 100mW; Voltage-Supply(Max): 50V; Temperature Coefficient: ±100ppm/℃; Operating Temperature: -55℃~+155℃
U4 = AP63203WU-7: LCSC Part Name: 3.8V至32V输入、2A低静态电流同步降压转换器，增强EMI抑制; Supplier Part: C780769; Manufacturer: DIODES(美台); Supplier Footprint: TSOT-23-6; JLCPCB Part Class: Extended Part; Datasheet: https://item.szlcsc.com/datasheet/AP63203WU-7/832852.html; Supplier: LCSC; Function: Buck; Voltage - Supply: 3.8V~32V; Output Voltage: 3.3V; Output Current: 2A; Frequency - Switching: 1.1MHz; Operating Temperature: -40℃~+85℃@(TA); Synchronous Rectifier: Yes; Number of Outputs: 1; Topology: Buck; Quiescent Current: 22uA; Switch tube (built-in/external): Built-In; Output Type: Fixed
U5 = TPS7A2033PDBVR: LCSC Part Name: 具有高 PSRR 的 300mA、超低噪声、低 IQ、低压降 (LDO) 线性稳压器; Supplier Part: C2862740; Manufacturer: TI(德州仪器); Supplier Footprint: SOT-23-5; JLCPCB Part Class: Extended Part; Datasheet: https://www.ti.com/cn/lit/gpn/tps7a20; Supplier: LCSC; Output Type: Fixed; Maximum Input Voltage: 6V; Output Voltage: 3.3V; Output Current: 300mA; Dropout Voltage: 140mV@(300mA); standby current: 15uA; Feature: 防静电保护；Soft Start；浪涌保护；低ESR；Thermal Protection(TSD)；欠压闭锁；Overcurrent Protection(OCP)；带使能；防倒灌; Operating Temperature: -40℃~+125℃@(Tj); Output Polarity: Positive electrode; Number of Outputs: 1
C1 C23 = 04025A100JAT2A: LCSC Part Name: 10pF ±5% 50V; Supplier Part: C513314; Manufacturer: Kyocera AVX; Supplier Footprint: 0402; JLCPCB Part Class: Extended Part; Datasheet: https://atta.szlcsc.com/upload/public/pdf/source/20200414/C513314_0189C030B5330A9F51F644C5673490BF.pdf; Supplier: LCSC; Tolerance: ±5%
C5 C24 = VZH470M1HTR-0607L: LCSC Part Name: 47uF ±20% 50V; Supplier Part: C2902971; Manufacturer: Lelon(立隆); Supplier Footprint: SMD,D6.3xL7.7mm; JLCPCB Part Class: Extended Part; Datasheet: https://item.szlcsc.com/datasheet/VZH470M1HTR-0607L/3158589.html; Supplier: LCSC; Tolerance: ±20%; Voltage Rating: 50V; Diameter: 6.3mm; Height - Seated (Max): 7.7mm; Operating Temperature: -55℃~+105℃
C2 C3 C6 C7 C25-C28 = CC1206KKX7R0BB225: Capacitance:2.2uF Tolerance:±10% Tolerance:±10% Voltage Rating:100V Temperature Coefficient:X7R; LCSC Part Name: 2.2uF ±10% 100V; Supplier Part: C577211; Manufacturer: YAGEO(国巨); Supplier Footprint: 1206; JLCPCB Part Class: Extended Part; Datasheet: https://item.szlcsc.com/datasheet/CC1206KKX7R0BB225/604702.html; Supplier: LCSC; Tolerance: ±10%; Voltage Rating: 100V; Temperature Coefficient: X7R
C8 C29 = CGA5L2X7R2A105KT0Y0S: Capacitance:1uF Voltage Rating:100V Temperature Coefficient:X7R; LCSC Part Name: 1uF 100V; Supplier Part: C5159418; Manufacturer: TDK; JLCPCB Part Class: Extended Part; Supplier: LCSC; Voltage Rating: 100V; Temperature Coefficient: X7R
L4 = YPRH105R-4R7M: Inductance: Tolerance:±20% Tolerance:±20% Rated Current: DC Resistance (DCR):; LCSC Part Name: 4.7uH ±20%; Supplier Part: C718262; Manufacturer: YJYCOIN(益嘉源); Supplier Footprint: SMD,10x10.2mm; JLCPCB Part Class: Extended Part; Datasheet: https://atta.szlcsc.com/upload/public/pdf/source/20200416/C514826_CE750259433DA69A4114CB3E759F4924.pdf; Supplier: LCSC; Tolerance: ±20%
R8 = RC0603FR-0749K9L: Type:Thick Film Resistor Resistance:49.9kΩ Tolerance:±1% Tolerance:±1% Power(Watts):100mW Voltage-Supply(Max):75V Temperature Coefficient:±100ppm/℃ Temperature Coefficient:±100ppm/℃ Operating Temperature:-55℃~+155℃ Operating Temperature:-55℃~+155℃; LCSC Part Name: 厚膜电阻 49.9kΩ ±1% 100mW; Supplier Part: C114624; Manufacturer: YAGEO(国巨); Supplier Footprint: 0603; JLCPCB Part Class: Extended Part; Datasheet: https://item.szlcsc.com/datasheet/RC0603FR-0749K9L/115868.html; Supplier: LCSC; Type: Thick Film Resistor; Tolerance: ±1%; Power(Watts): 100mW; Voltage-Supply(Max): 75V; Temperature Coefficient: ±100ppm/℃; Operating Temperature: -55℃~+155℃
R9 = FRC0603F1242TS: Type:Thick Film Resistor Resistance:12.4kΩ Tolerance:±1% Tolerance:±1% Power(Watts):100mW Voltage-Supply(Max):75V Temperature Coefficient:±100ppm/℃ Temperature Coefficient:±100ppm/℃ Operating Temperature:-55℃~+155℃ Operating Temperature:-55℃~+155℃; LCSC Part Name: 12.4kΩ ±1% 100mW 厚膜电阻; Supplier Part: C2930060; Manufacturer: FOJAN(富捷); Supplier Footprint: 0603; JLCPCB Part Class: Extended Part; Supplier: LCSC; Type: Thick Film Resistor; Tolerance: ±1%; Power(Watts): 100mW; Voltage-Supply(Max): 75V; Temperature Coefficient: ±100ppm/℃; Operating Temperature: -55℃~+155℃
U1 U3 = LMQ66430MC3RXBRQ1: LCSC Part Name: 降压型 3A 3.6V~36V; Supplier Part: C19271903; Manufacturer: TI(德州仪器); Supplier Footprint: VQFN-FCRLF-14(2.5x2.5); JLCPCB Part Class: Extended Part; Supplier: LCSC; Function: Buck; Voltage - Supply: 3.6V~36V; Output Current: 3A; Frequency - Switching: 2.2MHz; Operating Temperature: -40℃~+150℃@(TJ); Synchronous Rectifier: Yes; Number of Outputs: 1; Topology: Buck
D1 = MMSZ15T1G: Supplier Part: C27754; Manufacturer: onsemi(安森美); Supplier Footprint: SOD-123; JLCPCB Part Class: Extended Part; Datasheet: https://item.szlcsc.com/datasheet/MMSZ15T1G/28504.html; Supplier: LCSC; Diode Configuration: Independent; Zener Voltage(Nom): 15V; Reverse Leakage Current (Ir): 50nA@10.5V; Zener Voltage(Range): 14.25V~15.75V; Pd - Power Dissipation: 500mW; Impedance(Zzt): 30Ω; Operating Junction Temperature Range: -55℃~+150℃
D2 = SMCJ36A_C151282: LCSC Part Name: 单向TVS 36V截止 峰值浪涌电流：58.1A@10/1000us; Supplier Part: C151282; Manufacturer: Littelfuse(美国力特); Supplier Footprint: DO-214AB; JLCPCB Part Class: Extended Part; Datasheet: https://item.szlcsc.com/datasheet/SMCJ36A/162622.html; Supplier: LCSC; Polarity: Unidirectional; Reverse Stand-Off Voltage (Vrwm): 36V; Clamping Voltage: 58.1V; Peak Pulse Current (Ipp): 58.1A@10/1000us; Peak Pulse Power Dissipation (Ppp): 1.5kW@10/1000us; Voltage - Breakdown: 44.2V; Reverse Leakage Current (Ir): 1uA; Operating Temperature: -65℃~+150℃; level of protection: IEC 61000-4-2; Type: TVS
F1 = 0451005.MRL: LCSC Part Name: 125V贴片式保险丝; Supplier Part: C48467; Manufacturer: Littelfuse(美国力特); Supplier Footprint: 2410; JLCPCB Part Class: Extended Part; Datasheet: https://item.szlcsc.com/datasheet/0451005.MRL/49474.html; Supplier: LCSC; Type: Surface Mount Fuse; Current Rating: 5A; Voltage Rating (AC): 125V; Voltage Rating (DC): 125V; Operating Temperature: -55℃~+125℃; Interrupt Rating: 50A
L1 = BLM21PG300SN1D: LCSC Part Name: 单路 0805磁珠 阻抗30Ω@100MHz; Supplier Part: C16903; Manufacturer: muRata(村田); Supplier Footprint: 0805; JLCPCB Part Class: Extended Part; Datasheet: https://item.szlcsc.com/datasheet/BLM21PG300SN1D/17587.html; Supplier: LCSC; Impedance @ Frequency: 30Ω@100MHz; Tolerance: ±25%; DC Resistance(DCR): 14mΩ; Current Rating: 4A; Number of Circuits: 1
L2 = XGL6060-103MEC: Inductance:10uH Tolerance:±20% Tolerance:±20% Current Rating:- Current - Saturation(Isat):7.3A DC Resistance(DCR):20.4mΩ Type:Magnetic Shielded Inductor Ratings:AEC-Q200; LCSC Part Name: 10uH ±20% 7.3A; Supplier Part: C3911721; Manufacturer: Coilcraft(线艺); Supplier Footprint: SMD,6.7x6.5mm; JLCPCB Part Class: Extended Part; Datasheet: https://www.coilcraft.com/getmedia/329fe97c-7311-4726-9bf3-37718f42b168/xgl6060.pdf; Supplier: LCSC; Tolerance: ±20%; Current - Saturation(Isat): 7.3A; DC Resistance(DCR): 20.4mΩ; Type: Magnetic Shielded Inductor; Ratings: AEC-Q200
Q1 = E38P100KH: LCSC Part Name: P沟道,电流:38A,耐压:100V; Supplier Part: C29781155; Manufacturer: Existar(毅芯达); Supplier Footprint: PDFN5x6-8; JLCPCB Part Class: Extended Part; Datasheet: https://item.szlcsc.com/datasheet/E38P100KH/31514275.html; Supplier: LCSC; Number: 1 P-Channel; Drain to Source Voltage: 100V; Current - Continuous Drain(Id): 38A; RDS(on): 50mΩ@10V; Pd - Power Dissipation: 104W; Gate Threshold Voltage (Vgs(th)): 2.5V@250uA; Gate Charge(Qg): 81nC@10V; Input Capacitance(Ciss): 4.387nF; Reverse Transfer Capacitance (Crss@Vds): 150pF; Operating Temperature: -55℃~+150℃; Type: P-Channel; Output Capacitance(Coss): 228pF
R4 = 25121WF500LT4E: LCSC Part Name: 500mΩ ±1% 1W 厚膜电阻; Supplier Part: C27777; Manufacturer: UNI-ROYAL(厚声); Supplier Footprint: 2512; JLCPCB Part Class: Extended Part; Datasheet: https://atta.szlcsc.com/upload/public/pdf/source/20200306/C422600_1E6D84923E4A46A82E41ADD87F860B5C.pdf; Supplier: LCSC; Type: Thick Film Resistors; Tolerance: ±1%; Temperature Coefficient: ±800ppm/℃; Operating Temperature Range: -55℃~+155℃
R5 = FRC0603F4702TS: LCSC Part Name: 47kΩ ±1% 100mW 厚膜电阻; Supplier Part: C2907042; Manufacturer: FOJAN(富捷); Supplier Footprint: 0603; JLCPCB Part Class: Extended Part; Supplier: LCSC; Type: Thick Film Resistor; Tolerance: ±1%; Power(Watts): 100mW; Voltage-Supply(Max): 75V; Temperature Coefficient: ±100ppm/℃; Operating Temperature: -55℃~+155℃
R6 = FRC0603F8201TS: Type:Thick Film Resistor Resistance:8.2kΩ Tolerance:±1% Tolerance:±1% Power(Watts):100mW Voltage-Supply(Max):75V Temperature Coefficient:±100ppm/℃ Temperature Coefficient:±100ppm/℃ Operating Temperature:-55℃~+155℃ Operating Temperature:-55℃~+155℃; LCSC Part Name: 8.2kΩ ±1% 100mW 厚膜电阻; Supplier Part: C2907069; Manufacturer: FOJAN(富捷); Supplier Footprint: 0603; JLCPCB Part Class: Extended Part; Supplier: LCSC; Type: Thick Film Resistor; Tolerance: ±1%; Power(Watts): 100mW; Voltage-Supply(Max): 75V; Temperature Coefficient: ±100ppm/℃; Operating Temperature: -55℃~+155℃
U2 = TPS7A4701RGWR: LCSC Part Name: 1.4V~34V 1A 35V; Supplier Part: C90084; Manufacturer: TI(德州仪器); Supplier Footprint: VQFN-20-EP(5x5); JLCPCB Part Class: Extended Part; Datasheet: https://www.ti.com/cn/lit/gpn/tps7a47; Supplier: LCSC; Output Type: Adjustable; Voltage - Supply: 35V; Output Voltage: 1.4V~34V; Output Current: 1A; Power Supply Rejection Ratio (PSRR): 78dB@(1kHz); Voltage Dropout: 307mV@(1A); Noise: 4uVrms; Features: Over Current Protection; Operating Temperature: -40℃~+125℃@(Tj); Output Configuration: Positive; Number of Outputs: 1

## Nets
3.3V: C39.1 C40.1 C41.2 C49.2 C50.1 C67.2 C68.2 CN5.1 H2.2 H2.9 H2.11 L5.2 R1.2 R7.2 R10.2 R21.1 R22.2 R43.2 R44.2 R45.2 R46.2 R47.2 TP5.1 U1.13(MODE/SYNC) U3.13(MODE/SYNC) U4.1(FB) U6.2(3V3) U7.2 U10.2 U12.9(DAC_DVDD) U12.52(XPU) U13.1 U15.2
12V_GVDD: C17.1 C18.1 C19.1 C20.1 C21.1 C69.2 C87.2 TP3.1 TP18.1 U2.1(OUT) U2.3(SENSE/FB) U2.20(OUT) U12.12(GVDD_A) U12.30(GVDD_B)
+3.3VA: C43.1 C61.2 C62.2 TP7.1 U5.5(OUT) U12.56(DAC_AVDD)
+5V: C38.1 C42.1 C44.1 C52.1 C53.1 C104.2 C105.1 C106.1 D3.2(K) D5.2(K) H2.1 R11.2 TP4.1 U4.2(EN) U4.3(VIN) U5.1(IN) U8.4(VCC) U9.4(VCC) U11.2
+13.2V: C1.2 C9.1 C10.1 C11.1 C12.1 C13.1 C14.1 C15.2 L2.1 L3.2 R3.2 TP2.1
AGND: C42.2 C43.2 C61.1 C62.1 R27.1 R28.1 R29.1 R30.1 R49.1 TP8.1 U5.2(GND) U12.55(AGND)
GND: C2.2 C3.2 C4.2 C5.2 C6.2 C7.2 C8.2 C9.2 C10.2 C11.2 C12.2 C13.2 C14.2 C15.1 C16.2 C17.2 C18.2 C19.2 C20.2 C21.2 C22.2 C24.2 C25.2 C26.2 C27.2 C28.2 C29.2 C30.2 C31.2 C32.2 C33.2 C34.2 C35.2 C36.1 C38.2 C39.2 C40.2 C41.1 C44.2 C45.1 C46.1 C48.1 C49.1 C50.2 C52.2 C53.2 C54.2 C55.2 C65.1 C66.1 C67.1 C68.1 C69.1 C70.1 C71.1 C74.2 C75.2 C76.2 C77.1 C78.1 C79.1 C80.1 C81.1 C84.1 C85.1 C86.1 C87.1 C88.1 C89.1 C90.1 C91.1 C92.1 C93.1 C94.1 C95.1 C96.1 C97.1 C98.1 C99.1 C100.1 C101.1 C102.1 C103.1 C104.1 C105.2 C106.2 C107.1 CN1.2 CN5.2 D2.2 D4.2(GND) H2.15 H2.17 H2.19 H2.21 H2.22 H2.23 H2.24 H3.2 R5.1 R6.1 R9.1 R11.1 R12.2 R13.2 R14.1 R35.1 R36.1 R37.1 R38.1 R41.1 R42.2 R49.2 SW1.4 SW2.3 TP6.1 U1.6(PGND) U1.15(GND/DAP) U2.5(6P4V1) U2.6(3P2V) U2.7(GND) U2.9(0P8V) U2.11(0P2V) U2.21(EPAD) U3.6(PGND) U3.15(GND/DAP) U4.4(GND) U6.1(GND) U6.40(GND) U6.41(GND) U7.1 U8.3(GND) U9.3(GND) U10.1 U11.1 U12.7(GND) U12.10(DGND) U12.13(GND) U12.14(MODE) U12.22(GND) U12.33(GND) U12.37(GND) U12.38(GND) U12.42(GND) U15.1 USBC1.A1B12(GND) USBC1.B1A12(GND)
PVDD: C4.1 C54.1 C55.1 C74.1 C75.1 C76.1 C84.2 C85.2 C86.2 D2.1 L1.1 Q1.5(D) Q1.6(D) Q1.7(D) Q1.8(D) Q1.9(D) TP1.1 U12.35(PVDD_B) U12.40(PVDD_A)
PVDDLMQ: C2.1 C3.1 C5.1 C6.1 C7.1 C24.1 C25.1 C26.1 C27.1 C28.1 R4.2 U1.1(EN/UVLO) U1.3(VIN) U3.1(EN/UVLO) U3.3(VIN)
VBUS1: C107.2 D4.5(VBUS) L6.2 USBC1.A4B9(VBUS) USBC1.B4A9(VBUS)
A+: C88.2 C89.2 C90.2 C91.2 CN2.2 L7.2 L8.2
A-: C92.2 C93.2 C94.2 C95.2 CN2.1 L9.2 L10.2
B+: C96.2 C97.2 C98.2 C99.2 CN3.2 L11.2 L12.2
B-: C100.2 C101.2 C102.2 C103.2 CN3.1 L13.2 L14.2
DN: D4.3(IO2) USBC1.A7(DN1) USBC1.B7(DN2)
DP: D4.1(IO1) USBC1.A6(DP1) USBC1.B6(DP2)
DSP_RESET: U6.24(IO47) U10.3
DSP_SCL: R20.1 U10.5
DSP_SDA: R19.1 U10.4
DSP_SELFBOOT: U6.25(IO48) U10.6
ENABLE_3.3V: R10.1 U5.3(EN) U15.4
ENABLE_12V: R7.1 U2.13(EN) U15.8
ESP_TAS_ADR: H2.14 U6.20(IO12)
GOOD_13.2V: R1.1 U1.14(PG) U15.6
INA+: C57.1 U12.15(SPK_INA+)
INA-: C58.1 U12.16(SPK_INA-)
INB+: C60.1 U12.25(SPK_INB+)
INB-: C59.1 U12.26(SPK_INB-)
L_CKI: R17.1 U8.2(CKI)
L_SDI: R18.1 U8.1(SDI)
LRCK: R34.2 U11.4
MCLK: R31.2 U11.3
OUTA+: C72.1 L7.1 L8.1 TP20.1 U12.41(SPK_OUTA+)
OUTA-: C73.1 L9.1 L10.1 TP22.1 U12.39(SPK_OUTA-)
OUTB+: C83.1 L11.1 L12.1 TP24.1 U12.36(SPK_OUTB+)
OUTB-: C82.1 L13.1 L14.1 TP26.1 U12.34(SPK_OUTB-)
RXD: H2.5 TP11.1 U6.36(RXD0)
SCL: R20.2 R22.1 U6.26(IO45) U12.53(SCL)
SCLK: R32.2 U11.5
SDA: R19.2 R21.2 U6.27(IO0) U12.54(SDA)
SDIN: R33.2 U11.6
SDOUT: H3.4 R48.2
TAS_ADR: H2.13 R42.1 U12.46(ADR)
TAS_CLIP: LED2.2(K) R43.1 U12.29(CLIP_OTW#) U14.4
TAS_FAULT: LED1.1(K) R44.1 TP28.1 U12.28(FAULT#) U14.8
TAS_MUTE: R35.2 TP19.1 U12.45(DAC_MUTE#) U14.2
TAS_RESET: R45.1 TP29.1 U12.27(RESET_AMP#) U14.6
TXD: H2.3 TP10.1 U6.37(TXD0)
USBD+: D4.6(IO1) R15.1
USBD-: D4.4(IO2) R16.2
$1N618: C8.1 U1.10(VCC)
$1N622: L2.2 U1.7(SW)
$1N4748: C22.1 L3.1 U2.15(IN) U2.16(IN)
$1N5004: C16.1 U2.14(NR)
$1N14331: C1.1 R3.1 R6.2 U1.11(VOUT/FB)
$1N15560: D1.2(A) Q1.4(G) R2.1 R5.2
$1N16223: CN1.1 F1.1
$1N16230: D1.1(K) F1.2 Q1.1(S) Q1.2(S) Q1.3(S) R2.2
$1N16569: L1.2 R4.1
$2N991: C29.1 U3.10(VCC)
$2N992: L4.2 U3.7(SW)
$2N997: C23.1 R8.1 R9.2 U3.11(VOUT/FB)
$2N6924: C23.2 C30.1 C31.1 C32.1 C33.1 C34.1 C35.1 C36.2 D5.1(A) L4.1 R8.2
$3N1164: C37.2 L5.1 U4.5(SW)
$3N1261: C37.1 U4.6(BST)
$4N1079: R13.1 USBC1.B5(CC2)
$4N1568: C48.2 SW1.2 TP9.1 U6.3(EN)
$4N2917: C47.2 SW1.1
$4N2919: C47.1 SW1.3
$4N2955: C51.2 SW2.2
$4N2957: C51.1 SW2.4
$4N2996: SW2.1 TP12.1 U6.28(IO35)
$4N3000: C45.2 R14.2 USBC1.1(EH) USBC1.2(EH) USBC1.3(EH) USBC1.4(EH)
$4N3546: C46.2 D3.1(A) L6.1
$4N5397: U6.4(IO4) U7.3
$4N5403: U6.5(IO5) U7.4
$4N5413: U6.6(IO6) U7.5
$4N5420: U6.7(IO7) U7.6
$4N5498: H1.1 U6.8(IO15)
$4N5502: H1.2 U6.9(IO16)
$4N5507: H1.3 U6.10(IO17)
$4N5512: H1.4 U6.11(IO18)
$4N5878: H2.12 U6.19(IO11)
$4N5890: H2.16 U6.21(IO13)
$4N5979: H2.6 U6.16(IO46)
$4N6002: H2.10 U6.18(IO10)
$4N6037: H2.18 U6.22(IO14)
$4N6293: U6.34(IO41) U14.7
$4N6299: U6.35(IO42) U14.5
$4N6321: U6.38(IO2) U14.3
$4N6327: U6.39(IO1) U14.1
$4N6557: H2.7 U6.12(IO8)
$4N12444: U8.6(SDO) U9.1(SDI)
$4N12449: U8.5(CKO) U9.2(CKI)
$4N27607: R16.1 U6.13(IO19)
$4N27651: R15.2 U6.14(IO20)
$4N27686: H2.4 U6.15(IO3)
$4N27698: H2.8 U6.17(IO9)
$4N27768: H2.20 U6.23(IO21)
$4N29432: R12.1 USBC1.A5(CC1)
$4N30882: U6.33(IO40) U15.3
$4N30886: U6.32(IO39) U15.5
$4N30891: U6.31(IO38) U15.7
$4N30898: R17.2 U6.30(IO37)
$4N30902: R18.2 U6.29(IO36)
$5N1135: R31.1 TP14.1 U12.50(MCLK)
$5N1139: R32.1 TP15.1 U12.49(SCLK)
$5N1144: R33.1 TP16.1 U12.48(SDIN)
$5N1149: R34.1 TP17.1 U12.47(LRCK)
$5N1898: LED1.2(A) R46.1
$5N1937: LED2.1(A) R47.1
$5N2591: C82.2 U12.31(BST_B-)
$5N2739: C72.2 U12.44(BST_A+)
$5N2774: C83.2 U12.32(BST_B+)
$5N2778: C73.2 U12.43(BST_A-)
$5N7292: R26.2 U12.4(DAC_OUTA+)
$5N7296: R25.2 U12.3(DAC_OUTA-)
$5N7301: R24.2 U12.2(DAC_OUTB-)
$5N7306: R23.2 U12.1(DAC_OUTB+)
$5N7311: C56.2 C60.2 R23.1 R30.2
$5N7316: C56.1 C59.2 R24.1 R29.2
$5N7321: C58.2 C63.2 R25.1 R28.2
$5N7326: C57.2 C63.1 R26.1 R27.2
$5N7856: C65.2 C66.2 U12.5(CPVSS)
$5N8043: C81.2 U12.24(C_START)
$5N8280: R38.2 U13.3
$5N8424: R41.2 U13.7
$5N8429: R37.2 U13.5
$5N8563: U12.18(FREQ_ADJ) U13.2 U13.4 U13.6 U13.8
$5N10530: R39.2 U12.19(OSC_IOM)
$5N10534: H3.1 R39.1
$5N10618: H3.3 R40.1
$5N12212: C64.1 U12.6(CN)
$5N12216: C64.2 U12.8(CP)
$5N15270: R36.2 TP21.1 U12.17(OC_ADJ)
$5N39720: R48.1 U12.51(SDOUT)
$5N45518: R40.2 U12.20(OSC_IOP)
Net-(C70-2): C70.2 C71.2 U12.11(DVDD_REG)
Net-(C77-2): C77.2 C78.2 TP23.1 U12.21(DVDD)
Net-(C79-2): C79.2 C80.2 TP25.1 U12.23(AVDD)

Not connected (* = marked no-connect by the designer): U1 2(NC)* 4(NC)* 5(NC)* 8(BOOT)* 9(NC)* 12(NC)*; U2 2(NC)* 4(6P4V2)* 8(1P6V)* 10(0P4V)* 12(0P1V)* 17(NC)* 18(NC)* 19(NC)*; U3 2(NC)* 4(NC)* 5(NC)* 8(BOOT)* 9(NC)* 12(NC)* 14(PG)*; U5 4(NC)*; U9 5(CKO)* 6(SDO)*; USBC1 A8(SBU1)* B8(SBU2)*

## Notes on the sheets
sheet 1
- Keep in FPWM mode
- For PCB use:
  JLC04162H-7628 - sufficient
  JLC04162H-3313 - better
- LMQ66410 → 13.2V
  LC/ferrite filter
  low-noise TPS7A49 / TPS7A47 / LT1763 / TLV767 / TPS7A26  → 12V_GVDD
  local decoupling at TAS pins
sheet 2
- Keep in FPWM mode
- LMQ66430 → 5V_PVDD
    └── USB-C VBUS
          └── ideal diode / power mux
sheet 3
- 5V_SYS
           ├──  AP63203 -- 3.3V_DI
           └── ferrite bead → TPS7A20 → 3.3V_ANA
sheet 4
- I2S adresses:
  TAS3251 - 0x90 and 0x92
  ADAU1466 - 0x68
  (both ADDR pins to GND)
- Pick TAS address
  with jumber
- DSP controlling connector
  Keep it shorter than 30cm
sheet 5
- Only 1 L of this 2 is needed
